# EAGLE board EvaluationBoard (EAGLE 9.3.1)
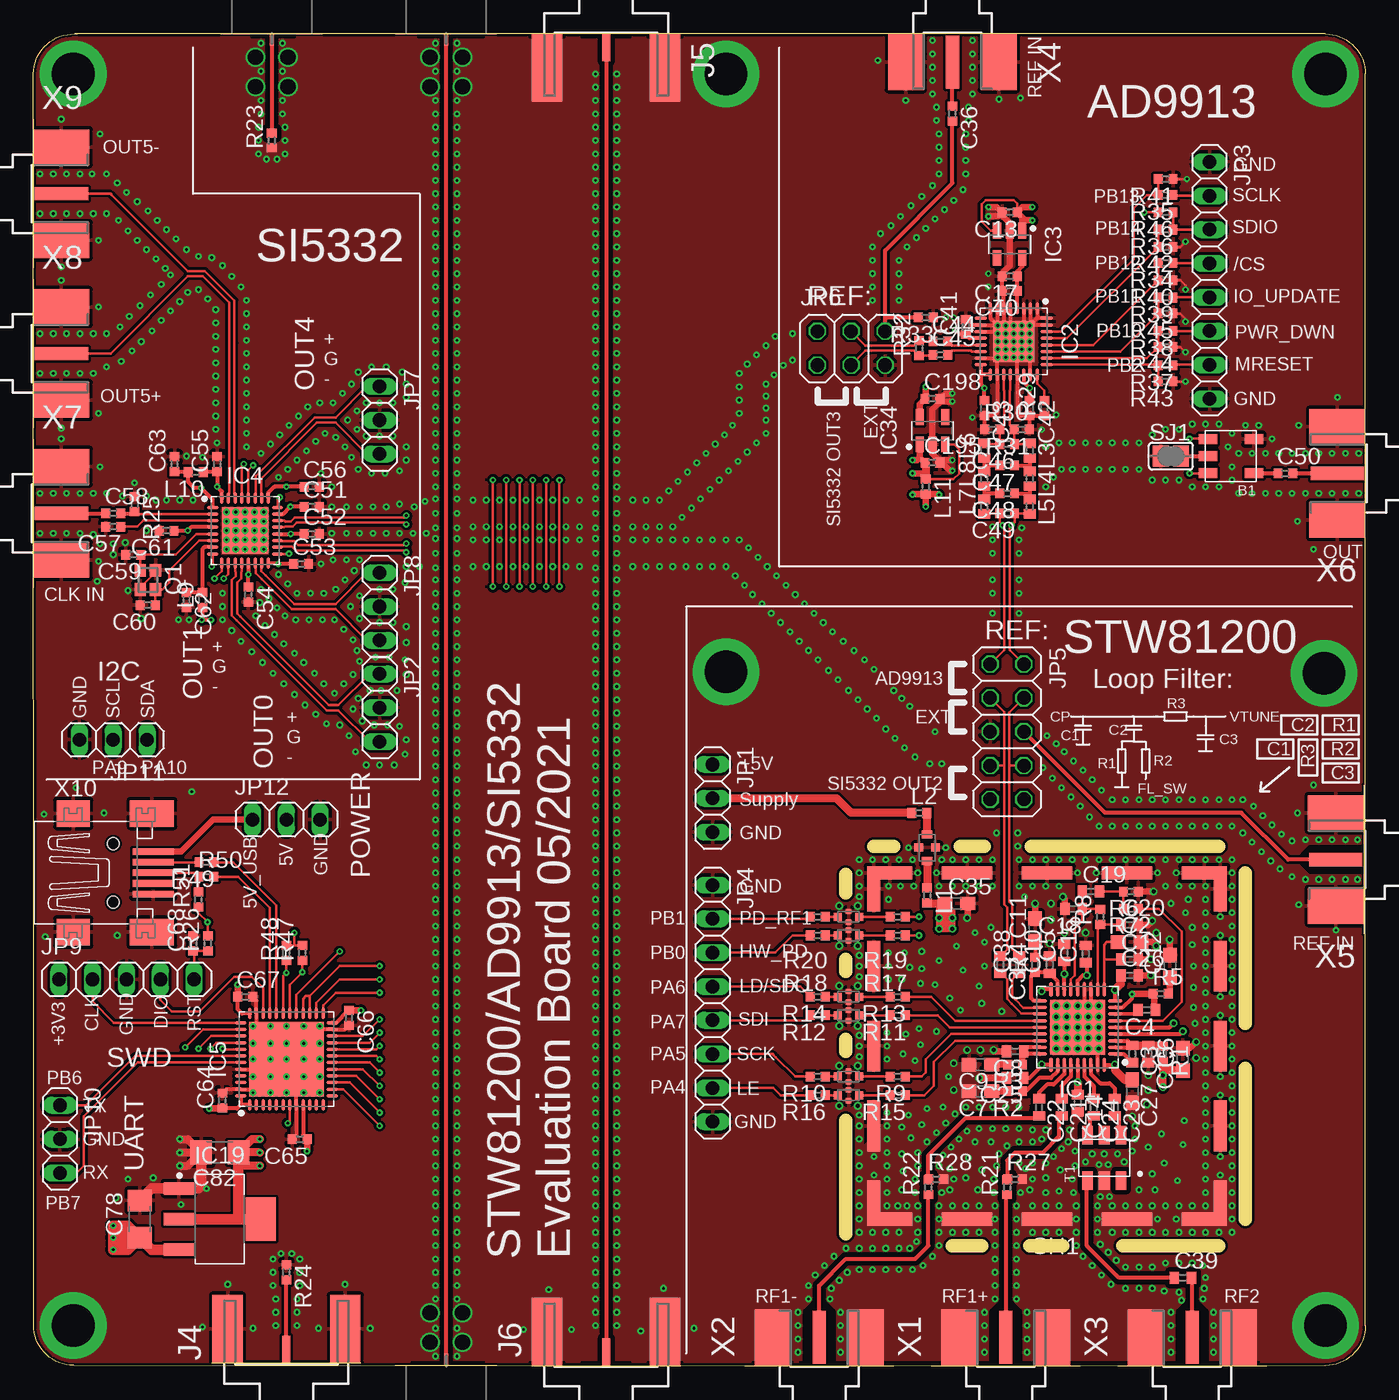
[diagram p5: board, top side]
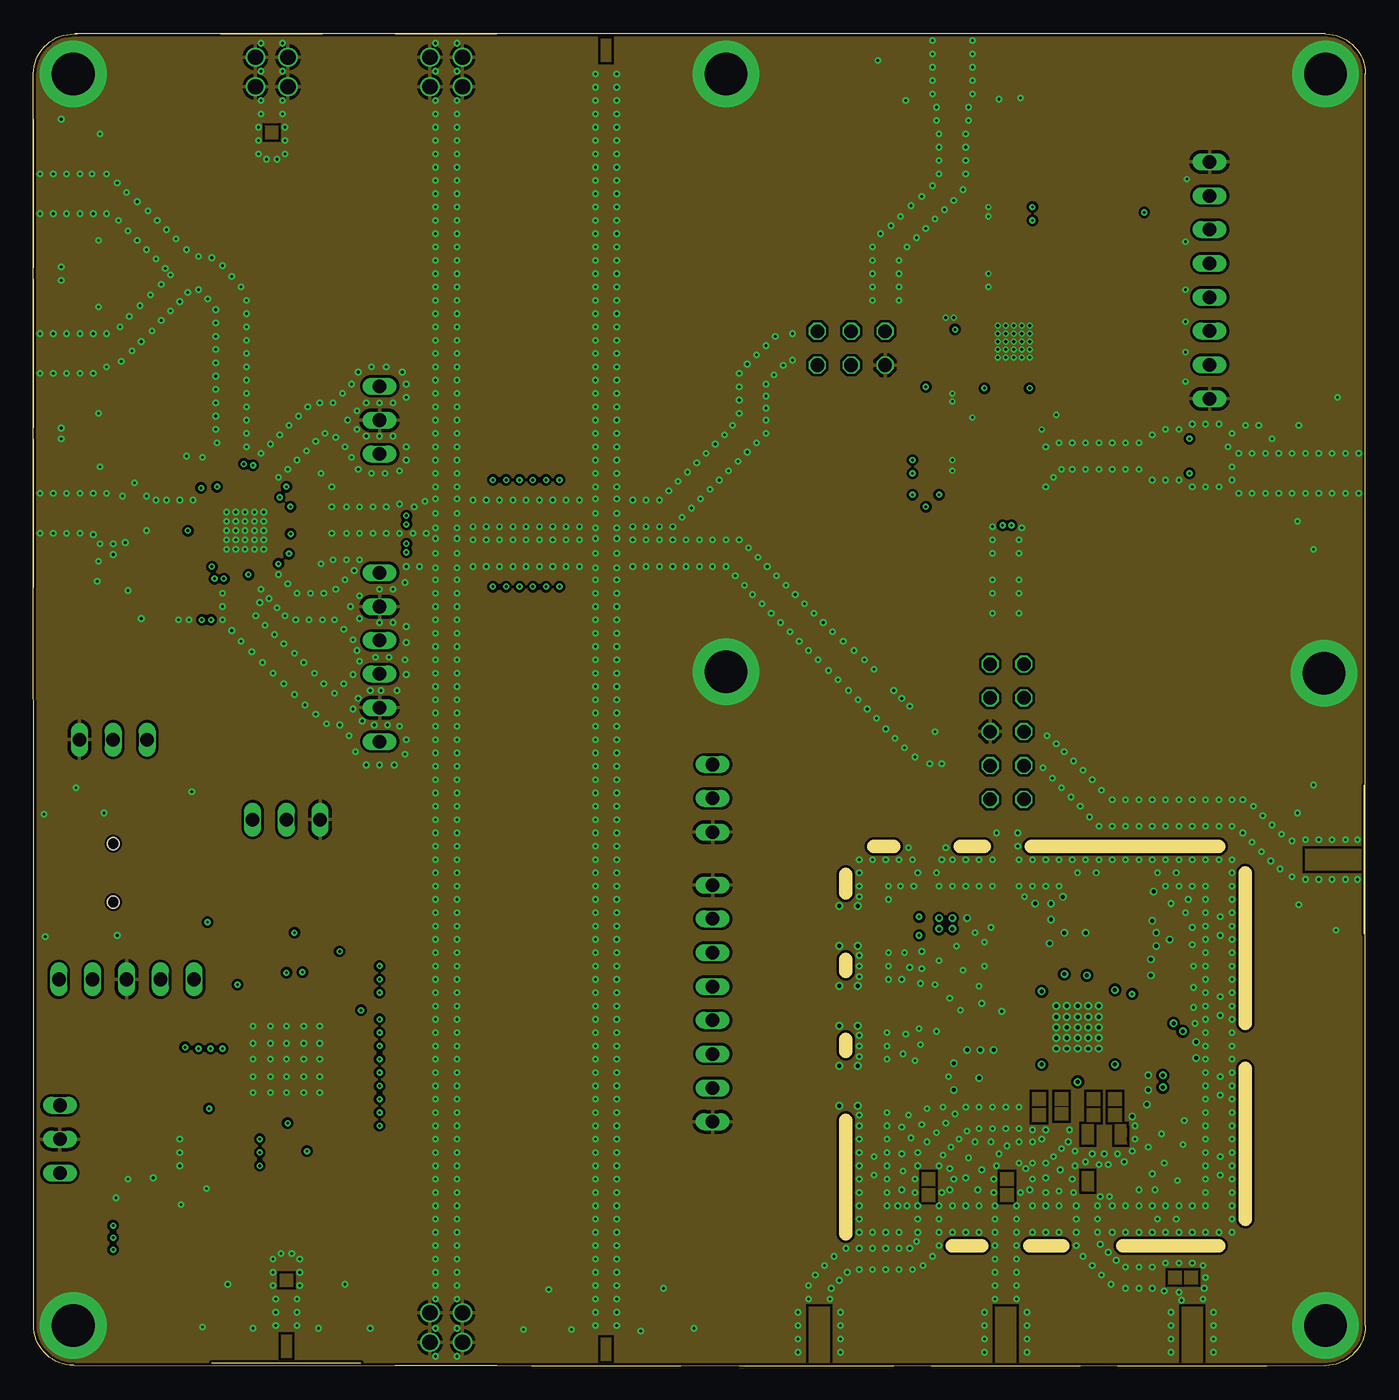
[diagram p6: board, inner layer Route2]
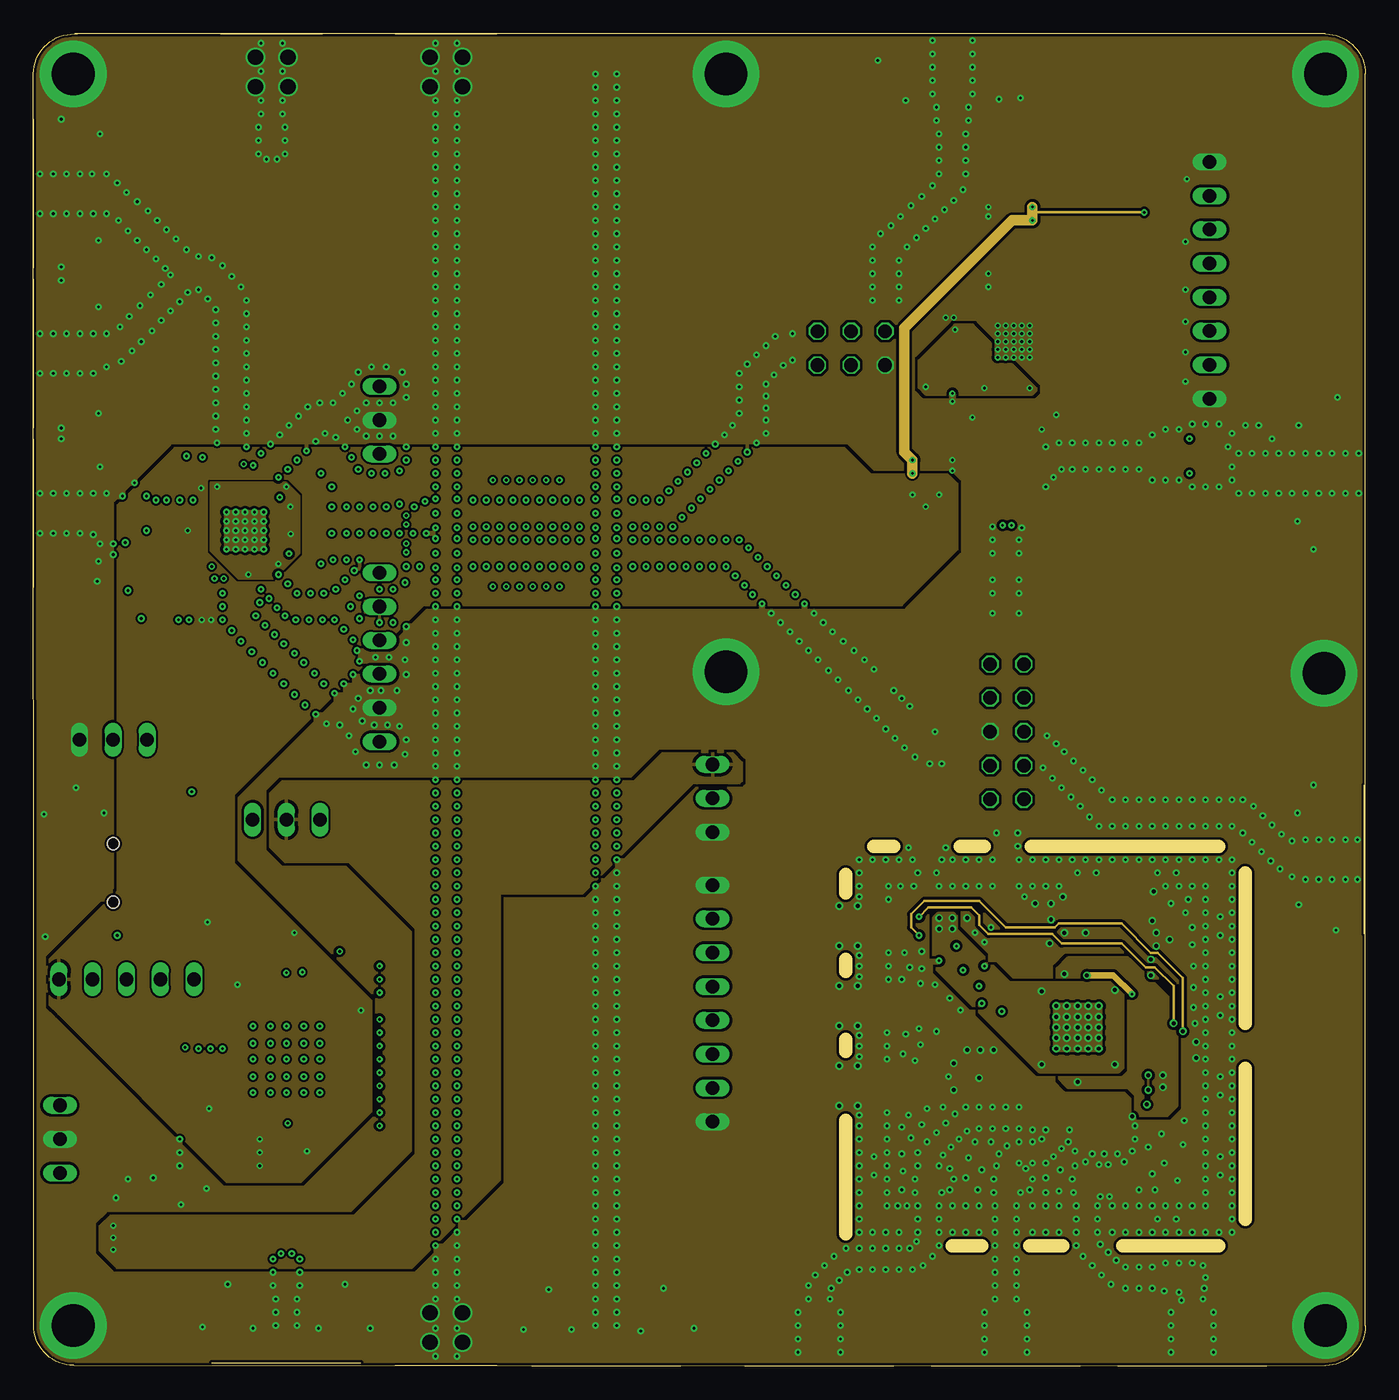
[diagram p7: board, inner layer Route15]
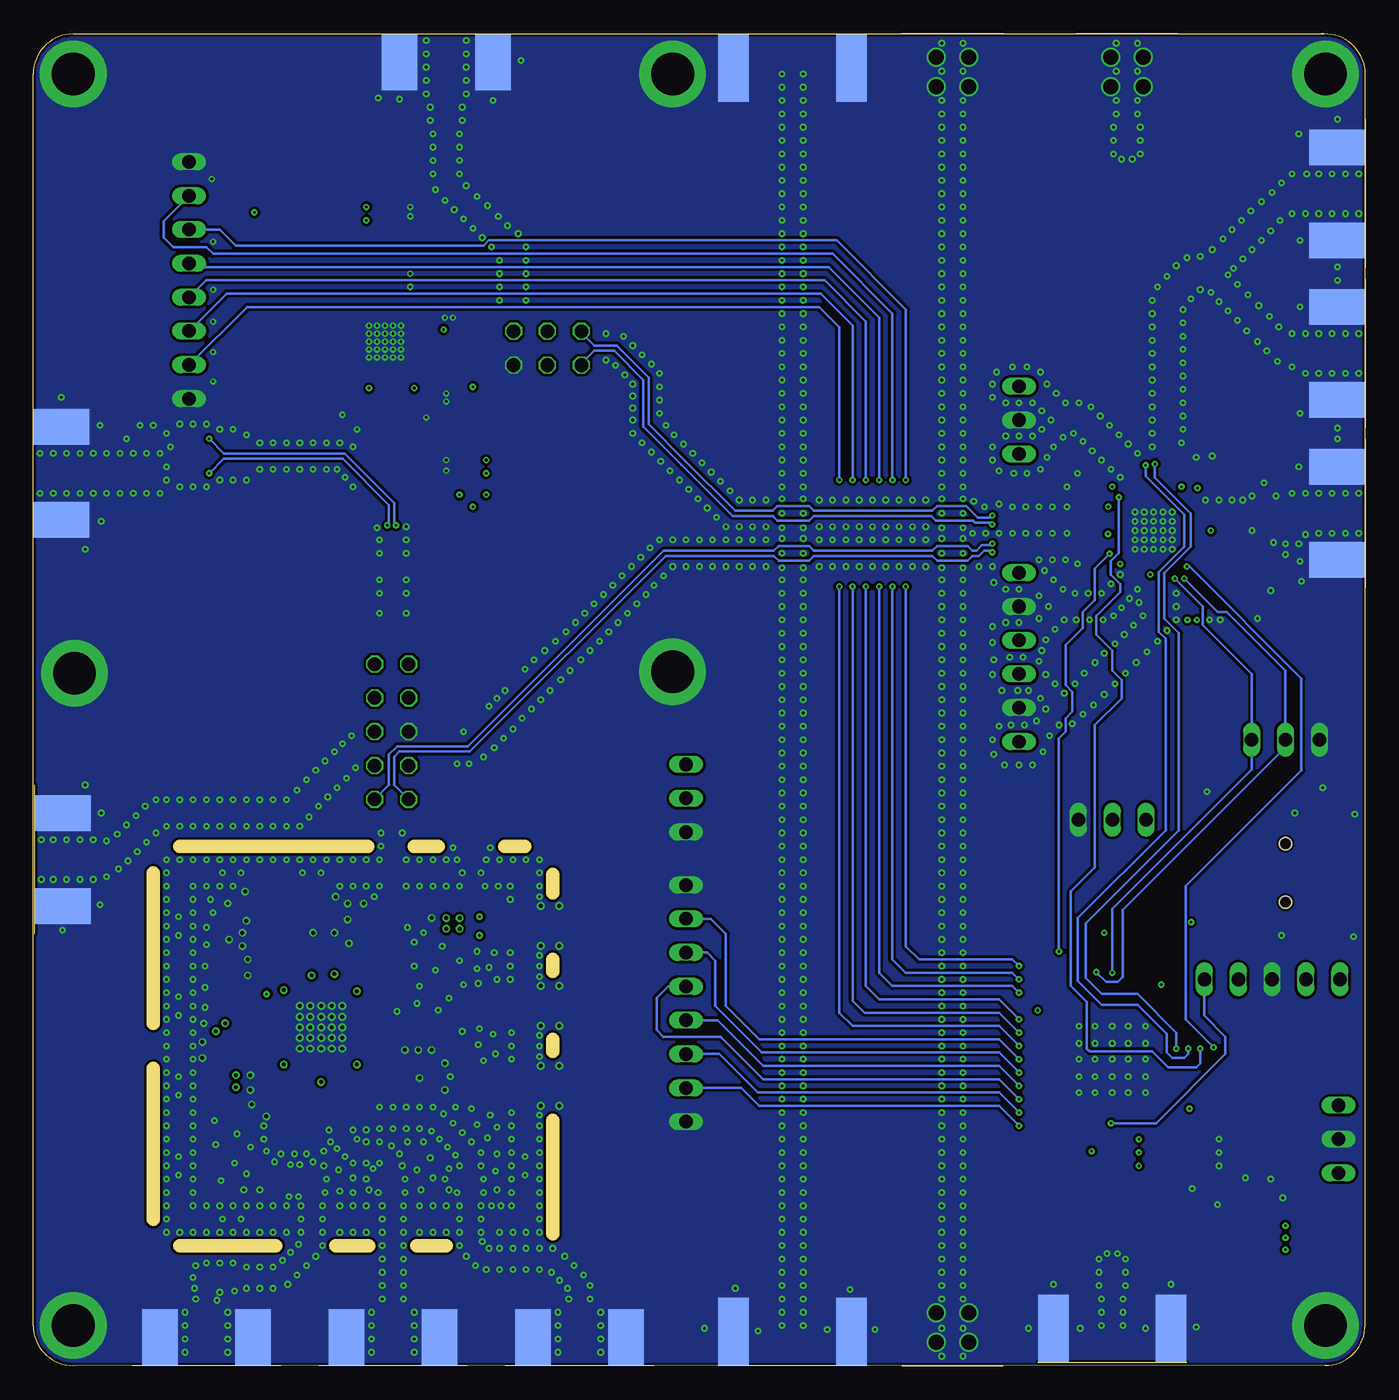
[diagram p8: board, bottom side, seen from below]

Size 100 x 100 mm. Coordinates in mm from the lower left corner, seen from the top.
Outline: 3.1,100 97,100 arc-90 100,97 100,3 arc-90 97,0 3.02,0.02 arc-90 0.02,3.02 0,97 arc-90 3.1,100
Outline: 3.1,100 3.3,100
Outline: 69,9 71.2,9
Outline: 74.8,9 77.3,9
Outline: 61,9.9 61,18.4
Outline: 61,23.6 61,24.5
Outline: 61,29.6 61,30.5
Outline: 81.8,9 89,9
Outline: 91,11 91,22.3
Outline: 91,37 91,25.7
Outline: 89,39 74.9,39
Outline: 61,35.5 61,36.9
Outline: 63.1,39 64.6,39
Outline: 69.6,39 71.4,39
Copper layers (1+2*15+16): Top 0.035mm / dielectric 0.2mm / Route2 0.0175mm / dielectric 1.064mm / Route15 0.0175mm / dielectric 0.2mm / Bottom 0.035mm
Design rules "JLCPCB4L_7628 *": minimum track width 6mil, minimum drill 0.2mm, track to track 3.5mil, track to pad 3.5mil, pad to pad 3.5mil, via to via 3.5mil, smd to smd 0mil, copper to edge 0.2mm, drill to drill 0.2mm, minimum pad ring 0.13mm, minimum via ring 0.13mm, stop-mask expansion 0.05mm, vias tented up to drill 0mil, thermal gap 10mil
Net classes: 1 100 Ohm differential: width 0.2 mm, drill 0.2 mm, clearance 0.2 mm
tRestrict: 16 lines
Milling: 12 lines

## Footprints (pad centres in the part's own frame; a part is rotated, then mirrored left to right if it is on the bottom)
SM-22 = smd 0.762 x 1.397: 1 -1.27,1.727; 2 0,1.727; 3 1.27,1.727; 4 1.27,-1.727; 5 -1.27,-1.727
C0402 = smd 0.7 x 0.9: 1 -0.65,0; 2 0.65,0
C0603 = smd 1.1 x 1: 1 -0.85,0; 2 0.85,0
C0402' = smd 0.67 x 0.72: 1 -0.56,0; 2 0.56,0
NFM18PC = smd 0.6 x 0.6: 1 -0.8,0; 3 0.8,0 | smd 0.4 x 0.4: 2 0,-0.4; 4 0,0.4
NFM21PC = smd 0.6 x 0.8: 1 -1,0; 3 1,0 | smd 0.6 x 0.65: 2 0,-0.625; 4 0,0.625
C1206 = smd 1.6 x 1.8: 1 -1.4,0; 2 1.4,0
QFN50P600X600X100-37T410N = smd 1.084 x 0.264: 1 -2.832,2; 2 -2.832,1.5; 3 -2.832,1; 4 -2.832,0.5; 5 -2.832,0; 6 -2.832,-0.5; 7 -2.832,-1; 8 -2.832,-1.5; 9 -2.832,-2; 19 2.832,-2; 20 2.832,-1.5; 21 2.832,-1; 22 2.832,-0.5; 23 2.832,0; 24 2.832,0.5; 25 2.832,1; 26 2.832,1.5; 27 2.832,2 | smd 0.264 x 1.084: 10 -2,-2.832; 11 -1.5,-2.832; 12 -1,-2.832; 13 -0.5,-2.832; 14 0,-2.832; 15 0.5,-2.832; 16 1,-2.832; 17 1.5,-2.832; 18 2,-2.832; 28 2,2.832; 29 1.5,2.832; 30 1,2.832; 31 0.5,2.832; 32 0,2.832; 33 -0.5,2.832; 34 -1,2.832; 35 -1.5,2.832; 36 -2,2.832 | smd 4.1 x 4.1: 37 0,0
QFN50P500X500X80-33T310 = smd 0.937 x 0.27: 1 -2.487,1.75; 2 -2.487,1.25; 3 -2.487,0.75; 4 -2.487,0.25; 5 -2.487,-0.25; 6 -2.487,-0.75; 7 -2.487,-1.25; 8 -2.487,-1.75; 17 2.487,-1.75; 18 2.487,-1.25; 19 2.487,-0.75; 20 2.487,-0.25; 21 2.487,0.25; 22 2.487,0.75; 23 2.487,1.25; 24 2.487,1.75 | smd 0.27 x 0.937: 9 -1.75,-2.487; 10 -1.25,-2.487; 11 -0.75,-2.487; 12 -0.25,-2.487; 13 0.25,-2.487; 14 0.75,-2.487; 15 1.25,-2.487; 16 1.75,-2.487; 25 1.75,2.487; 26 1.25,2.487; 27 0.75,2.487; 28 0.25,2.487; 29 -0.25,2.487; 30 -0.75,2.487; 31 -1.25,2.487; 32 -1.75,2.487 | smd 3.1 x 3.1: 33 0,0
SOT95P240X110-5 = smd 1.18 x 0.609: 1 -1.024,0.95; 2 -1.024,0; 3 -1.024,-0.95; 4 1.024,-0.95; 5 1.024,0.95
QFN50P500X500X100-33T345N = smd 0.86 x 0.27: 1 -2.435,1.75; 2 -2.435,1.25; 3 -2.435,0.75; 4 -2.435,0.25; 5 -2.435,-0.25; 6 -2.435,-0.75; 7 -2.435,-1.25; 8 -2.435,-1.75; 17 2.435,-1.75; 18 2.435,-1.25; 19 2.435,-0.75; 20 2.435,-0.25; 21 2.435,0.25; 22 2.435,0.75; 23 2.435,1.25; 24 2.435,1.75 | smd 0.27 x 0.86: 9 -1.75,-2.435; 10 -1.25,-2.435; 11 -0.75,-2.435; 12 -0.25,-2.435; 13 0.25,-2.435; 14 0.75,-2.435; 15 1.25,-2.435; 16 1.75,-2.435; 25 1.75,2.435; 26 1.25,2.435; 27 0.75,2.435; 28 0.25,2.435; 29 -0.25,2.435; 30 -0.75,2.435; 31 -1.25,2.435; 32 -1.75,2.435 | smd 3.45 x 3.45: 33 0,0
QFN50P700X700X60-49T560N = smd 0.86 x 0.27: 1 -3.435,2.75; 2 -3.435,2.25; 3 -3.435,1.75; 4 -3.435,1.25; 5 -3.435,0.75; 6 -3.435,0.25; 7 -3.435,-0.25; 8 -3.435,-0.75; 9 -3.435,-1.25; 10 -3.435,-1.75; 11 -3.435,-2.25; 12 -3.435,-2.75; 25 3.435,-2.75; 26 3.435,-2.25; 27 3.435,-1.75; 28 3.435,-1.25; 29 3.435,-0.75; 30 3.435,-0.25; 31 3.435,0.25; 32 3.435,0.75; 33 3.435,1.25; 34 3.435,1.75; 35 3.435,2.25; 36 3.435,2.75 | smd 0.27 x 0.86: 13 -2.75,-3.435; 14 -2.25,-3.435; 15 -1.75,-3.435; 16 -1.25,-3.435; 17 -0.75,-3.435; 18 -0.25,-3.435; 19 0.25,-3.435; 20 0.75,-3.435; 21 1.25,-3.435; 22 1.75,-3.435; 23 2.25,-3.435; 24 2.75,-3.435; 37 2.75,3.435; 38 2.25,3.435; 39 1.75,3.435; 40 1.25,3.435; 41 0.75,3.435; 42 0.25,3.435; 43 -0.25,3.435; 44 -0.75,3.435; 45 -1.25,3.435; 46 -1.75,3.435; 47 -2.25,3.435; 48 -2.75,3.435 | smd 5.6 x 5.6: 49 0,0
SOT230P700X180-4 = smd 2.265 x 0.929: 1 -3.073,2.3; 2 -3.073,0; 3 -3.073,-2.3 | smd 2.265 x 3.229: 4 3.073,0
AMPHENOL_901-10510-2 = drill 1.14 pad 1.44: G1 -1.75,1.22; G2 -3.96,1.22; G3 -3.96,-1.22; G4 -1.75,-1.22 | smd 0.9 x 0.3: S -0.45,0
BU-1420701851 = smd 2.1 x 0.6: 1 1,0 | smd 5.08 x 2.286: G@1 2.565,4.42; G@2 2.565,-4.42 | smd 5.08 x 2.286 bottom: G@3 2.565,4.42; G@4 2.565,-4.42
1X03 = drill 1.016 long: 1 -2.54,0; 2 0,0; 3 2.54,0
1X08 = drill 1.016 long: 1 -8.89,0; 2 -6.35,0; 3 -3.81,0; 4 -1.27,0; 5 1.27,0; 6 3.81,0; 7 6.35,0; 8 8.89,0
2X05 = drill 1.016 octagon: 1 -5.08,-1.27; 2 -5.08,1.27; 3 -2.54,-1.27; 4 -2.54,1.27; 5 0,-1.27; 6 0,1.27; 7 2.54,-1.27; 8 2.54,1.27; 9 5.08,-1.27; 10 5.08,1.27
2X03 = drill 1.016 octagon: 1 -2.54,-1.27; 2 -2.54,1.27; 3 0,-1.27; 4 0,1.27; 5 2.54,-1.27; 6 2.54,1.27
1X05 = drill 1.016 long: 1 -5.08,0; 2 -2.54,0; 3 0,0; 4 2.54,0; 5 5.08,0
R0402 = smd 0.67 x 0.72: 1 -0.56,0; 2 0.56,0
L0402 = smd 0.7 x 0.9: 1 -0.548,0; 2 0.548,0
FA-128 = smd 0.95 x 0.85: 1 -0.725,-0.575; 2 0.725,-0.575; 3 0.725,0.575; 4 -0.725,0.575
TE_2118718-2 = smd 3.4 x 1: 1 1.7,0.5; 5 25.3,0.5; 11 25.3,26.5; 15 1.7,26.5 | smd 3.8 x 1: 2 7.5,0.5; 3 13.5,0.5; 4 19.5,0.5; 12 19.5,26.5; 13 13.5,26.5; 14 7.5,26.5 | smd 1 x 3.4: 6 0.5,1.7; 10 0.5,25.3; 16 26.5,25.3; 20 26.5,1.7 | smd 1 x 3.8: 7 0.5,7.5; 8 0.5,13.5; 9 0.5,19.5; 17 26.5,19.5; 18 26.5,13.5; 19 26.5,7.5
SJ = smd 1.168 x 1.6: 1 -0.762,0; 2 0.762,0
EASTEVER_BALUN = smd 1.4 x 0.8: 1 -1.715,-1.25; 2 -1.715,0; 3 -1.715,1.25; 4 1.715,1.25; 5 1.715,0; 6 1.715,-1.25
J502-ND-142-0711-821/826 = smd 4 x 1: 1 2.115,0 | smd 4.191 x 2.667: G@1 2.115,3.495; G@2 2.115,-3.495 | smd 4.191 x 2.667 bottom: G@3 2.115,3.495; G@4 2.115,-3.495
32005-301 = smd 3.1 x 0.5: 1 3,1.6; 2 3,0.8; 3 3,0; 4 3,-0.8; 5 3,-1.6 | smd 2.5 x 2: M1 -3,-4.45; M2 -3,4.45 | smd 3.3 x 2: M3 2.9,4.45; M4 2.9,-4.45 | hole 0.9: 0,2.2; 0,-2.2

## Placement (x,y rotation side)
B1  ETC1-1T-2  [SM-22]  89.9,68.3 90 top
C1  220n  [C0402]  82.3,30.5 0 top
C2  10u  [C0603]  82.3,31.8 0 top
C3  100n  [C0402]  82.5,23.4 270 top
C4  100n  [C0402]  83.59,26.71 180 top
C5  220n  [C0402]  77.4,31 90 top
C6  10u  [C0603]  86.3,23 90 top
C7  10u  [C0603]  71.1,20.6 180 top
C8  220n  [C0402]  73.7,23.6 180 top
C9  10u  [C0603]  71.1,22.6 180 top
C10  220n  [C0402]  76.3,30.1 90 top
C11  10u  [C0603]  75.2,32.7 90 top
C12  10u  [C0603]  85.33,29.98 90 top
C13  1u  [C0402']  73.3,86.6 180 top
C14  220n  [C0402]  78.4,19.7 270 top
C15  1n  [C0402]  83.7,23.4 270 top
C16  10n  [C0402]  79,30.9 90 top
C17  1u  [C0402']  73.3,81.8 180 top
C18  DNP  [C0402]  78.1,34.3 180 top
C19  DNP  [C0402]  79.4,35.6 0 top
C20  DNP  [C0402]  82.3,33.1 0 top
C21  1n  [C0402]  77.2,19.4 270 top
C22  1n  [C0402]  75.5,19.4 270 top
C23  1n  [C0402]  81.2,19.4 270 top
C24  1n  [C0402]  79.6,19.4 270 top
C25  100n  [C0402]  73.7,21.6 180 top
C26  100n  [C0402]  82.3,29.3 0 top
C27  10u  [C0603]  82.5,20.6 270 top
C28  NFM18CC101R1C3D  [NFM18PC]  61.2,21.7 0 top
C29  NFM18CC101R1C3D  [NFM18PC]  61.2,26.3 0 top
C30  NFM18CC101R1C3D  [NFM18PC]  61.2,27.7 0 top
C31  NFM18CC101R1C3D  [NFM18PC]  61.2,20.3 0 top
C32  NFM18CC101R1C3D  [NFM18PC]  61.2,32.3 0 top
C33  NFM18CC101R1C3D  [NFM18PC]  61.2,33.7 0 top
C34  NFM21PC475B1A3D  [NFM21PC]  67.1,38.9 270 top
C35  10u  [C0603]  69.3,34.7 0 top
C36  100n  [C0402']  69,94 270 top
C37  10n  [C0402]  72.6,30.1 270 top
C38  10n  [C0402]  74,30.1 90 top
C39  1n  [C0402]  86.3,6.6 0 top
C40  100n  [C0402']  73.3,80.7 180 top
C41  100n  [C0402']  70,78 90 top
C42  100n  [C0402']  74.8,71.9 270 top
C43  100n  [C0402']  71.4,71.9 270 top
C44  100n  [C0402']  68.1,76.9 0 top
C45  100n  [C0402']  68.1,75.9 0 top
C46  12p  [C0402']  73.1,69.2 180 top
C47  47p  [C0402']  73.1,67.6 180 top
C48  47p  [C0402']  73.1,65.5 180 top
C49  12p  [C0402']  73.1,64 180 top
C50  1u  [C0402']  94,67 0 top
C51  100n  [C0402']  20.9,64.5 0 top
C52  100n  [C0402']  20.9,62.45 0 top
C53  100n  [C0402']  20.1,60.2 0 top
C54  100n  [C0402']  16.15,57.9 270 top
C55  100n  [C0402']  13.8,67.7 90 top
C56  100n  [C0402']  20.9,66 0 top
C57  100n  [C0402']  6,63 180 top
C58  100n  [C0402']  6,64 0 top
C59  4p  [C0402']  7.5,60.9 180 top
C60  4p  [C0402']  8.6,57.1 180 top
C61  100n  [C0402']  10,62.7 180 top
C62  1u  [C0402']  11.5,57.5 270 top
C63  1u  [C0402']  10.6,67.7 90 top
C64  100n  [C0402']  14.2,19.9 90 top
C65  100n  [C0402']  20,17 180 top
C66  100n  [C0402']  23.7,26.1 270 top
C67  100n  [C0402']  15.9,27.7 0 top
C68  100n  [C0402']  12,31.7 90 top
C78  10u  [C1206]  8,11 90 top
C82  10u  [C1206]  14,16 180 top
C195  1u  [C0402']  67.5,67.8 0 top
C198  1u  [C0402']  67.5,72.6 0 top
IC1  STW81200  [QFN50P600X600X100-37T410N]  78.4,25.4 180 top
IC2  AD9913  [QFN50P500X500X80-33T310]  73.6,76.9 270 top
IC3  NCP702-1.8  [SOT95P240X110-5]  73.3,84.2 270 top
IC4  SI5332A-GM1  [QFN50P500X500X100-33T345N]  15.9,62.7 0 top
IC5  STM32L462CE  [QFN50P700X700X60-49T560N]  19,23 90 top
IC19  AP2114H  [SOT230P700X180-4]  14,11 0 top
IC34  NCP702-1.8  [SOT95P240X110-5]  67.5,70.2 90 top
J1  AMPHENOL_901-10510-2  [AMPHENOL_901-10510-2]  17.9,100 90 top
J2  AMPHENOL_901-10510-2  [AMPHENOL_901-10510-2]  31,0 270 top
J3  AMPHENOL_901-10510-2  [AMPHENOL_901-10510-2]  31,100 90 top
J4  BU-1420701851  [BU-1420701851]  19,0.2 90 top
J5  BU-1420701851  [BU-1420701851]  43,100 270 top
J6  BU-1420701851  [BU-1420701851]  43,0 90 top
JP1  [1X03]  51,42.6 270 top
JP2  [1X03]  26,49.4 270 top
JP3  [1X08]  88.3,81.5 270 top
JP4  [1X08]  51,27.2 270 top
JP5  [2X05]  73.1,47.6 270 top
JP6  [2X03]  61.4,76.4 0 top
JP7  [1X03]  26,71 270 top
JP8  [1X03]  26,57 270 top
JP9  [1X05]  7,29 0 top
JP10  [1X03]  2,17 270 top
JP11  [1X03]  6,47 180 top
JP12  [1X03]  19,41 0 top
L1  FERRITE  [R0402]  67.1,35.3 270 top
L2  FERRITE  [R0402]  66.5,41.5 0 top
L3  LQW15AWR16J80D  [L0402]  74.8,68.7 270 top
L4  LQW15CAR27J00D  [L0402]  74.8,66.6 270 top
L5  LQW15AWR16J80D  [L0402]  74.8,64.5 270 top
L6  LQW15AWR16J80D  [L0402]  71.4,68.7 90 top
L7  LQW15AWR16J80D  [L0402]  71.4,64.5 90 top
L8  LQW15CAR27J00D  [L0402]  71.4,66.6 90 top
L9  FERRITE  [R0402]  12.7,57.5 90 top
L10  FERRITE  [R0402]  12.2,67.1 180 top
L11  FERRITE  [R0402]  67,66 270 top
Q1  FA-128 26MHz  [FA-128]  8.6,59 270 top
R1  0R2  [R0402]  84.8,23.4 270 top
R2  0R5  [R0402]  73.7,20.6 180 top
R3  0R5  [R0402]  73.7,22.6 180 top
R4  0R5  [R0402]  75.2,30.1 90 top
R5  0R2  [R0402]  84.65,27.93 0 top
R6  DNP  [R0402]  82.4,35.6 180 top
R7  DNP  [R0402]  82.4,34.3 180 top
R8  DNP  [R0402]  80.1,33.7 90 top
R9  22  [R0402]  64.9,21.7 180 top
R10  22  [R0402]  58.9,21.7 180 top
R11  22  [R0402]  64.9,26.3 180 top
R12  22  [R0402]  58.9,26.3 180 top
R13  22  [R0402]  64.9,27.7 180 top
R14  22  [R0402]  58.9,27.7 180 top
R15  22  [R0402]  64.9,20.3 180 top
R16  22  [R0402]  58.9,20.3 180 top
R17  22  [R0402]  64.9,32.3 180 top
R18  22  [R0402]  58.9,32.3 180 top
R19  22  [R0402]  64.9,33.7 180 top
R20  22  [R0402]  58.9,33.7 180 top
R21  0  [R0402]  73.1,13.4 90 top
R22  0  [R0402]  67.2,13.4 90 top
R23  [R0402]  17.9,92 90 top
R24  [R0402]  19,7 270 top
R25  49R9  [R0402]  7.6,64.7 270 top
R26  10k  [R0402]  13.1,31.7 90 top
R27  DNP  [R0402]  73.7,14 0 top
R28  DNP  [R0402]  67.8,14 0 top
R29  49R9  [R0402]  75.9,71.9 90 top
R30  49R9  [R0402]  72,70.3 0 top
R31  49R9  [R0402]  74.2,70.3 180 top
R32  100  [R0402]  66.5,76.4 90 top
R33  100  [R0402]  67,78.7 180 top
R34  1k  [R0402]  85,82.8 180 top
R35  1k  [R0402]  85,87.9 180 top
R36  1k  [R0402]  85,85.3 180 top
R37  1k  [R0402]  85,75.1 180 top
R38  1k  [R0402]  85,77.7 180 top
R39  1k  [R0402]  85,80.2 180 top
R40  1k  [R0402]  85,81.5 180 top
R41  1k  [R0402]  85,89.1 180 top
R42  1k  [R0402]  85,84 180 top
R43  1k  [R0402]  85,73.9 180 top
R44  1k  [R0402]  85,76.5 180 top
R45  1k  [R0402]  85,79 180 top
R46  10k  [R0402]  85,86.6 180 top
R47  4k7  [R0402]  20.2,31 90 top
R48  4k7  [R0402]  19,31 90 top
R49  22  [R0402]  13,37.8 180 top
R50  22  [R0402]  13,36.7 0 top
R51  1k5  [R0402]  12.4,35 90 top
SH1  TE_2118718-2  [TE_2118718-2]  89.6,37.5 180 top
SJ1  [SJ]  85.4,68.3 0 top
T1  B012-617DB-1-63-B331  [EASTEVER_BALUN]  80.4,15.6 90 top
X1  SMA_CONNECTOR  [J502-ND-142-0711-821/826]  73,0 90 top
X2  SMA_CONNECTOR  [J502-ND-142-0711-821/826]  59,0 90 top
X3  SMA_CONNECTOR  [J502-ND-142-0711-821/826]  87,0 90 top
X4  SMA_CONNECTOR  [J502-ND-142-0711-821/826]  69,100 270 top
X5  SMA_CONNECTOR  [J502-ND-142-0711-821/826]  99.9,38 180 top
X6  SMA_CONNECTOR  [J502-ND-142-0711-821/826]  100,67 180 top
X7  SMA_CONNECTOR  [J502-ND-142-0711-821/826]  0,64 0 top
X8  SMA_CONNECTOR  [J502-ND-142-0711-821/826]  0,76 0 top
X9  SMA_CONNECTOR  [J502-ND-142-0711-821/826]  0,88 0 top
X10  MINI-USB-SCHIELD-32005-301  [32005-301]  6,37 0 top

## Tracks (layer width: path | path; a pad name or v marks a point on that pad's centre or on a via)
+3V3  (via drill 0.2)
  Top 0.2: R48.2 19.6,31.56 | 19.6,31.56 R47.2 | 19.6,31.56 v19.6,32.5 | R51.1 12.4,33.98 v13.08,33.3 13.08,32.28 R26.2
  Top 0.3: IC4.4 11.85,62.95 v11.6,62.7 C61.1 | IC5.9 20.25,17.31 C65.1 | IC5.24 22.75,25.75 23.66,26.66 C66.1 | IC5.36 15.66,26.43 15.34,26.76 C67.1 | IC5.1 15.56,19.57 | 15.56,19.57 15.3,19.3 14.24,19.3 C64.1 | IC5.48 15.56,19.57 | IC4.1 13.46,65.03 v12.6,65.9 12.1,65.9 11.64,66.36 L10.2 10.64,67.1 C63.1 | v13.35,56 v12.65,56 12.7,56.05 L9.1
  Top 0.5: C67.1 15.34,28.59 v15.32,28.6 | 23.66,26.66 24.59,26.66 v24.6,26.68 | C65.1 v20.56,16.11 v20.55,16.1 | 14.24,19.3 v13.2,19.3 | v67,64.5 L11.2 | v68,65.4 67.96,65.44 L11.2 | v66,65.4 66.04,65.44 L11.2
  Top 0.6: v17,16 C82.1 16.4,17 v17,17 | v17,15 15.4,15
  Top 0.8: IC19.2 15.3,11 | 15.3,11 IC19.4 | C82.1 15.4,15 15.4,11.1 15.3,11
  pour Route15 (isolate 0.15, rank 2): 15.6,13.8 20.1,13.8 22.8,16.5 25.4,19.1 25.4,27.4 15.1,37.7 15.1,42.9 29.3,57.1 65.2,57.1 69.4,61.3 69.4,66.2 68.7,66.9 62.9,66.9 60.9,68.9 10.6,68.9 6.3,64.6 6.3,56.5 6.3,35.6 1.2,30.5 1.2,27.1 1.9,26.4 14.5,13.8
+5V  (via drill 0.2)
  Top 0.8: IC19.3 8.9,8.7 C78.1 | C78.1 v6,9.6 | C78.1 7.35,8.95 | 7.35,8.95 7.1,8.7 v6,8.7 | C78.1 7.4,10.2 | 7.4,10.2 7.1,10.5 v6,10.5 | v6,10.5 v6,9.6 | v6,9.6 v6,8.7 | v6,8.7 6.25,8.95 7.35,8.95 | v6,10.5 6.3,10.2 7.4,10.2
  pour Route15 (isolate 0.15): 5,10.5 5.8,11.3 24.1,11.3 28.7,15.9 28.7,32.8 23.7,37.8 18.9,37.8 17.8,38.9 17.8,43 18.7,43.9 45.1,43.9 47.2,46 52.5,46 53.2,45.3 53.2,43.9 53,43.7 49.5,43.7 41.2,35.4 35,35.4 35,13.9 28.4,7.3 6.3,7.3 5,8.6
AD9913_CS  (via drill 0.2)
  Top 0.2: JP3.4 85.59,82.77 R34.1 | IC5.25 21.75,27.05 22.7,28 v26,28 | v36.5,58.5 v36.5,66.5
  Bottom 0.2: v26,28 26.5,28.5 35.5,28.5 36.5,29.5 v36.5,58.5 | v36.5,66.5 36.5,78.7 40.3,82.5 88.03,82.5 JP3.4
AD9913_IO_UPDATE  (via drill 0.2)
  Top 0.2: JP3.5 85.59,80.23 R39.1 | IC5.22 24.75,24.75 v26,26 | v37.5,58.5 v37.5,66.5
  Bottom 0.2: v26,26 27.5,27.5 36.5,27.5 37.5,28.5 v37.5,58.5 | v37.5,66.5 37.5,78.4 40.6,81.5 87.03,81.5 JP3.5
AD9913_IOUT_N
  Top 0.2: IC2.19 72.85,73.25 72.9,73.2 72.9,70.9 72.9,70.64 R30.2 72.56,69.22 C46.2 71.45,69.2 L6.2
AD9913_IOUT_P
  Top 0.2: IC2.20 73.35,73.25 73.3,73.2 73.3,70.9 73.3,70.64 R31.2 73.64,69.22 C46.1 74.75,69.2 L3.1
AD9913_MRESET  (via drill 0.2)
  Top 0.2: JP3.7 85.61,75.15 R37.1 | IC5.20 25.75,23.75 v26,24 | v39.5,58.5 v39.5,66.5
  Bottom 0.2: v26,24 27.5,25.5 38.5,25.5 39.5,26.5 v39.5,58.5 | v39.5,66.5 39.5,78 41,79.5 83.95,79.5 JP3.7
AD9913_OUT_N  (via drill 0.2)
  Top 0.2: L7.1 71.45,64 C49.2 72.54,63.33 v72.77,63.1 72.9,63.1 72.9,54.1 72.9,53.75 JP5.1 | B1.3 88.14,69.6 v86.8,69.6
  Bottom 0.2: v86.8,69.6 85.7,68.5 76.62,68.5 72.9,64.78 72.9,64.58 72.9,63.1 v72.77,63.1
AD9913_OUT_P  (via drill 0.2)
  Top 0.2: L5.2 74.75,64 C49.1 73.66,63.44 73.66,63.33 v73.43,63.1 73.3,63.1 73.3,54.1 73.3,53.75 JP5.2 | v86.8,67 88.14,67 B1.1
  Bottom 0.2: v86.8,67 85.7,68.1 76.78,68.1 73.3,64.62 73.3,64.42 73.3,63.1 v73.43,63.1
AD9913_PWR_DWN  (via drill 0.2)
  Top 0.2: JP3.6 R38.1 | IC5.21 25.25,24.25 v26,25 | v38.5,58.5 v38.5,66.5
  Bottom 0.2: v26,25 27.5,26.5 37.6,26.5 38.5,27.4 v38.5,58.5 | v38.5,66.5 38.5,78.1 40.9,80.5 85.49,80.5 JP3.6
AD9913_REF_IN_N
  Top 0.2: C45.1 67.48,75.84 R32.1 66.14,76.2 62.47,76.2 JP6.3
AD9913_REF_IN_P
  Top 0.2: C44.1 66.56,76.9 R32.2 66.14,76.6 65.5,76.6 62.5,76.6 62.47,76.6 JP6.4
AD9913_REF_LVDS_N  (via drill 0.2)
  Top 0.2: IC4.21 18.85,62.95 18.9,63 19.48,63 19.78,63.3 20.9,63.3 28,63.3 v28,63.17
  Bottom 0.2: v28,63.17 28,63.3 28.7,63.3 29.3,63.3 29.4,63.4 29.45,63.45 32.25,63.45 32.6,63.8 32.7,63.8 40.1,63.8 41.4,63.8 41.75,63.45 42.73,63.45 44.15,63.45 44.5,63.8 47,63.8 47.48,63.8 51.34,67.66 54.2,70.52 54.2,74.02 56.38,76.2 57.9,76.2 58.86,75.24 JP6.1
AD9913_REF_LVDS_P  (via drill 0.2)
  Top 0.2: IC4.22 18.85,63.45 18.9,63.4 19.32,63.4 19.62,63.7 20.9,63.7 28,63.7 v28,63.83
  Bottom 0.2: v28,63.83 28,63.7 28.7,63.7 29.1,63.7 29.8,64.4 29.95,64.55 32.15,64.55 32.5,64.2 32.7,64.2 40.1,64.2 41.4,64.2 41.75,64.55 44.15,64.55 44.5,64.2 47,64.2 47.32,64.2 51.06,67.94 53.8,70.68 53.8,74.18 56.22,76.6 57.9,76.6 58.86,77.56 JP6.2
AD9913_REF_N
  Top 0.2: IC2.14 70.45,76.15 70.4,76.2 68.96,76.2 C45.2
AD9913_REF_P
  Top 0.2: IC2.13 70.45,76.65 70.4,76.6 69.3,76.6 68.96,76.6 C44.2
AD9913_SCLK  (via drill 0.2)
  Top 0.2: JP3.2 85.61,87.85 R35.1 | IC5.26 21.25,27.25 23,29 v26,29 | v35.5,58.5 v35.5,66.5
  Bottom 0.2: v26,29 26.5,29.5 34.5,29.5 35.5,30.5 v35.5,58.5 | v35.5,66.5 35.5,79 40,83.5 86.5,83.5 87,84 89.5,84 90.2,84.7 90.2,85.95 JP3.2
AD9913_SDIO  (via drill 0.2)
  Top 0.2: JP3.3 R36.1 R46.1 | 20.75,27.75 23,30 v26,30 | 20.75,27.75 IC5.27 | 20.75,27.75 20.45,27.75 20.25,27.55 IC5.28 | v34.5,58.5 v34.5,66.5
  Bottom 0.2: v26,30 26.5,30.5 33.5,30.5 34.45,31.45 | 34.45,31.45 34.5,31.5 | 34.45,31.45 34.5,31.5 | 34.5,31.5 v34.5,58.5 | v34.5,66.5 34.5,79.3 39.7,84.5 65.8,84.5 66.2,84.1 84.8,84.1 86.01,85.31 JP3.3
CUTOUT
  Route2 0: 53,0 54,0
  pour Route2 (no thermals): 59.8,0 59.8,4.4 58.2,4.4 58.2,0
  pour Route2 (no thermals): 99.9,38.8 95.5,38.8 95.5,37.2 99.9,37.2
  pour Route2 (no thermals): 73.8,0 73.8,4.4 72.2,4.4 72.2,0
  pour Route2 (no thermals): 87.8,0 87.8,4.4 86.2,4.4 86.2,0
  pour Route2 (isolate 0.36): 42.6,0 42.6,2.1 43.4,2.1 43.4,0
  pour Route2 (isolate 0.36): 18.6,0.2 18.6,2.3 19.4,2.3 19.4,0.2
  pour Route2 (isolate 0.36): 42.6,97.9 42.6,100 43.4,100 43.4,97.9
  pour Route2 (no thermals): 67.7,14.5 67.7,13.5 66.7,13.5 66.7,14.5
  pour Route2 (no thermals): 67.7,13.3 67.7,12.3 66.7,12.3 66.7,13.3
  pour Route2 (no thermals): 73.6,14.5 73.6,13.5 72.6,13.5 72.6,14.5
  pour Route2 (no thermals): 73.6,13.3 73.6,12.3 72.6,12.3 72.6,13.3
  pour Route2 (no thermals): 85.2,7.1 86.2,7.1 86.2,6.1 85.2,6.1
  pour Route2 (no thermals): 86.4,7.1 87.4,7.1 87.4,6.1 86.4,6.1
  pour Route2 (no thermals): 75,19.5 75,20.5 76,20.5 76,19.5
  pour Route2 (no thermals): 75,18.3 75,19.3 76,19.3 76,18.3
  pour Route2 (no thermals): 76.7,18.4 76.7,19.4 77.7,19.4 77.7,18.4
  pour Route2 (no thermals): 76.7,19.5 76.7,20.5 77.7,20.5 77.7,19.5
  pour Route2 (no thermals): 79.1,19.5 79.1,20.5 80.1,20.5 80.1,19.5
  pour Route2 (no thermals): 79.1,18.3 79.1,19.3 80.1,19.3 80.1,18.3
  pour Route2 (no thermals): 80.7,18.3 80.7,19.3 81.7,19.3 81.7,18.3
  pour Route2 (no thermals): 80.7,19.5 80.7,20.5 81.7,20.5 81.7,19.5
  pour Route2 (isolate 0.36): 78.7,18.1 79.6,18.1 79.6,16.6 78.7,16.6
  pour Route2 (isolate 0.36): 81.2,18.1 82.1,18.1 82.1,16.6 81.2,16.6
  pour Route2 (isolate 0.36): 78.7,14.6 79.6,14.6 79.6,13.1 78.7,13.1
  pour Route2 (no thermals): 19.5,6.9 19.5,5.9 18.5,5.9 18.5,6.9
  pour Route2 (no thermals): 18.4,93.1 18.4,92.1 17.4,92.1 17.4,93.1
GND  (via drill 0.2, 0.2 pad 0.5, 0.3 pad 0.5, 0.3 pad 0.6, 3.2 pad 5)
  Top 0.2: R41.1 v86.6,89.1 | R42.1 86.1,84 v86.5,84.4 | R40.1 86.1,81.5 86.5,81.1 v86.5,80.8 | R45.1 86.1,79 86.5,78.6 v86.5,78.4 | R44.1 86.1,76.5 v86.5,76.1 | R43.1 v86.5,73.9 | Q1.4 9.18,59.58 8.03,58.42 Q1.2
  Top 0.3: IC1.13 78.9,27.3 v79.2,27 79.4,27.2 IC1.12 | IC1.35 79.9,23.7 v80,23.8 | 72.35,78.15 IC2.10 70.41,78.15 C41.2 | 72.35,78.15 v72.4,78.1 72.35,78.15 | IC2.11 72.25,77.65 v72.4,77.5 | IC2.31 74.8,78.15 | 74.8,78.15 74.25,78.15 | 74.25,78.15 v74.2,78.1 | IC2.3 74.35,78.25 74.25,78.15 | IC2.2 74.85,78.2 74.8,78.15 | IC2.1 75.35,78.7 74.8,78.15 | IC2.32 75.35,78.65 v74.8,78.1 | IC2.5 73.35,78.35 v73.6,78.1 | v73,78.1 72.85,78.25 IC2.6 72.85,80.59 C40.2 C17.2 | IC2.7 72.35,78.15 | IC2.8 71.85,78.65 72.35,78.15 | IC2.23 74.85,76.25 v74.8,76.3 | v74.2,76.3 73.85,75.95 IC2.21 73.85,71.55 74.06,71.34 C42.2 | 72.35,75.65 IC2.18 72.35,71.55 72.14,71.34 C43.2 71.44,71.3 R30.1 | 72.35,75.65 v72.4,75.7 | R31.1 74.8,70.34 C42.2 | C42.2 R29.1 | IC2.15 72.35,75.65 | C62.2 11.54,56.9 | C65.2 19.75,17.31 IC5.8 19.75,20.55 19.7,20.6 19.8,20.5 v20.3,20.5 | v16.5,20.5 16.25,20.75 IC5.47 14.49,20.75 C64.2 | IC5.44 17.25,22.25 v17.8,21.7 | v16.5,25.5 16.75,25.75 IC5.35 16.75,27.41 C67.2 | v21.5,25.5 21.75,25.25 IC5.23 23.41,25.25 C66.2
  Top 0.5: C25.2 v71,21.6 | C8.2 72.1,23.6 v72.1,23.7 | C6.2 86.85,23.85 v87.3,24.3 | C26.2 v83.9,29.3 | C1.2 v83.9,30.5 | C2.2 84,31.8 v84.3,31.5 | C20.2 83.7,33.1 v84,33.4 | C12.2 85.33,31.97 v85.3,32 | R6.1 v84.1,35.6 | C18.2 77.45,35.05 v77.3,35.2 | C11.2 v75.2,34.7 | C35.2 70.15,33.65 v70.1,33.6 | C17.2 72.74,82.04 73.3,82.6 IC3.2 73.3,85.8 72.74,86.36 C13.2 | 68.06,67.94 C195.2 | 68.06,67.94 67.5,68.5 IC34.2 67.5,71.8 68.06,72.36 C198.2 | v71.7,87 72.34,87 C13.2 | v71.7,86.3 72.44,86.3 C13.2 | v69,72.4 68.26,72.4 C198.2 | v69,73 68.46,73 C198.2 | v69,68 68.12,68 68.06,67.94 | v69,67.2 68.8,67.2 68.06,67.94
  Top 0.6: v11,16 C82.2 | v11,17 11.6,17 C82.2 | v11,15 11.6,15 C82.2
  Top 0.8: C78.2 8.9,13.3 IC19.1 12.4,13.3 12.6,13.5 C82.2
  other vias: 78.4,25.4 76.8,25.4 77.6,25.4 77.6,24.6 78.4,24.6 78.4,23.8 77.6,23.8 76.8,23.8 76.8,24.6 76.8,26.2 76.8,27 77.6,27 77.6,26.2 78.4,26.2 78.4,27 80,27 80,26.2 79.2,26.2 79.2,25.4 80,25.4 80,24.6 79.2,24.6 79.2,23.8 79,32.5 77.4,32.5 76.3,31.7 76.4,33.5 76.4,34.7 84.3,32.5 82.5,18.7 83.6,19.6 83.7,21.8 83.7,20.7 87.3,23.1 71.1,23.7 70.1,23.7 69.1,22.7 69.1,20.7 60.6,3 59.8,5 60.6,2 60.6,1 60.6,4 62,7.2 61.1,7 60.5,6.4 59.9,5.8 63,7.2 64,7.2 65,7.2 66,7.2 65,8.8 65.8,8.8 64,8.8 63,8.8 62,8.8 61,8.8 57.4,1 57.4,2 57.4,3 57.4,4 58.2,5 58.2,6 58.7,6.8 59.4,7.5 60.1,8.2 68,9 68,10 68,11 68,12 66.4,11 66.4,10 66.3,9.3 66.4,12 66.8,7.5 67.5,8.2 74,19.4 73,19.4 72,19.4 71,19.4 70,19.4 74,17.8 75,17.7 76,17.7 73,17.8 72,17.8 71,17.8 68.2,13 68.8,13.2 69.1,14 68,15 68.8,14.8 68.3,15.8 68.9,16.4 69.5,17 70.1,17.6 66.4,16 66.4,15 66.2,14 66.2,13 67.1,16.8 67.8,17.5 68.5,18.2 69.2,18.9 75,16.8 74,16.8 75.7,17 74,15.2 75,15.2 76,15.2 76.6,15.7 77.2,16.3 77.7,16.8 77.8,17.7 72.2,5 72.2,6 72.2,7 72.2,8 72.2,9 72.2,10 72.2,11 72.2,12 73.8,12 73.8,11 73.8,10 73.8,9 73.8,8 73.8,7 73.8,6 73.8,5 71.4,1 71.4,2 71.4,3 71.4,4 74.6,4 74.6,3 74.6,2 74.6,1 72.1,13 72.1,14 72.3,15 72.5,15.9 73.1,16.5 74.1,13 74.8,13.2 75,14 74.5,14.8 78.3,11 78.3,10 78.3,9 78.8,8.2 79.5,7.5 80.2,6.8 80.9,6.1 82,5.8 83,5.8 84,5.8 84.9,5.6 86,5.5 86.2,4.9 85.4,4 85.4,3 85.4,2 85.4,1 88.6,1 88.6,2 88.6,3 88.6,4 87.8,5 87.9,5.8 88,6.6 87,7.7 87.8,7.5 86,7.7 85,7.7 84,7.4 83,7.4 82,7.4 81.3,7.9 80.7,8.5 80.1,9.1 79.9,10 79.9,11 79.9,12 80.1,12.7 80.8,12.7 78.3,12 78.1,13 78,14 78.2,15 79,15.3 80,15.1 80.7,15.1 80.4,15.9 79.5,15.9 81.4,15.9 81.9,15.3 78.2,16.1 82.7,18 82.7,17 82.5,16.1 69,12 70,12 71,12 75,12 76,12 77,12 81,12 82,12 83,12 84,12 85,12 86,12 87,12 88,12 88,13 88,14 88,15 88,16 88,17 88,18 88,19 88,20 88,21 88,22 88,23 88,24 88,25 88,26 88,27 88,28 88,29 88,30 88,31 88,32 88,36 88,35 88,34 88,33 87,36 86,36 85,36 64.1,12 64.9,12 65.6,12 64.1,13 64.1,14 64.1,15 64.1,16 64.1,17 64.1,18 64.1,19 64.1,23 64.1,24 64.1,25 64.2,29 64.2,30 64.2,31 64.2,35 64.2,36 65.1,36 66.1,36 68,36 69,36 70,36 71,36 72,36 74,36 75,36 76,36 77,36 78.4,37 79.8,37 84.4,37 85.8,37 89.1,33.7 89.1,32.3 89.1,26.3 89.1,27.7 89.1,21.7 89.1,20.3 89.1,14.3 89.1,15.7 85.8,11 84.4,11 63.1,14.3 63.1,15.7 67.8,37 66.4,37 81,10 82,10 83,10 84,10 85,10 86,10 87,10 88,10 89,10 90,10 90,11 90,12 90,13 90,14 90,15 90,16 90,17 90,18 90,19 90,20 90,21 90,22 90,23 90,24 90,25 90,26 90,27 90,28 90,29 90,30 90,31 90,32 90,33 90,34 90,35 90,36 90,37 90,38 89,38 88,38 87,38 86,38 85,38 84,38 83,38 82,38 81,38 80,38 79,38 78,38 77,38 76,38 75,38 74,38 72,38 71,38 70,38 69,38 66,38 68.2,38 68.5,38.9 65.7,38.9 65,38 64,38 63,38 62,38 62,37 62,36 62,35.2 62,30 62,30.8 62,29.2 62,24 62,24.8 62,23.2 62,18 62,18.8 62,17 62,16 62,15 62,14 62,13 62,12 62,11 62,10 63,10 64,10 65,10 60.5,19.5 61.9,19.5 60.5,22.5 61.9,22.5 60.5,25.5 61.9,25.5 60.5,28.5 61.9,28.5 60.5,34.5 61.9,34.5 60.5,31.5 61.9,31.5 69,10 70,10 71,10 75,10 76,10 77,10 73.9,39 73.9,40 72.3,40 3,97 97,97 97,3 3,3 85.9,13.9 86.3,16.6 86.4,18.4 84.7,17.4 83.7,16.4 84.9,15.2 84.2,13.2 84,14.4 83,13.2 77,13.1 76,14.1 77.1,14.7 76,13 70.9,13.2 70,14.1 71.2,14.7 70.2,15.6 70.7,16.8 71.9,16.8 65.2,13.2 65.3,14.6 65.2,15.9 65.9,17.1 65.2,17.9 65.7,18.8 67.1,19.3 66.7,18.1 68.3,19.4 68.7,21.7 66.2,22.9 67.8,25.1 66.5,25.3 66.6,24.1 65.5,24.9 65.3,23.4 87.1,30 87,31.6 87,32.9 86.5,34 86.7,35 85.4,34.7 87.1,28.4 87.1,26.9 87.2,25.7 74.4,35.2 70.7,32.5 71.4,31.8 71.9,32.9 69.6,26.7 68.8,27.6 67.7,28.6 66.6,28.7 66.7,29.8 66.7,31.1 65.4,31 65.8,29.9 65.2,29 68,30.4 69.3,31.5 69.8,29.7 71.4,30 71.2,27.2 72.7,26.6 71,28.5 30.2,5 30.2,2.8 30.2,0.7 31.8,0.7 31.8,2.8 31.8,5 31.8,6 31.8,7 31.8,8 31.8,9 31.8,10 31.8,11 31.8,12 31.8,13 31.8,14 31.8,15 31.8,16 31.8,17 31.8,18 31.8,19 31.8,20 31.8,21 31.8,22 31.8,23 31.8,24 31.8,25 31.8,26 31.8,27 31.8,28 31.8,29 31.8,30 31.8,31 31.8,32 31.8,33 31.8,34 31.8,35 31.8,36 31.8,37 31.8,38 31.8,39 31.8,40 31.8,41 31.8,42 31.8,43 31.8,44 31.8,45 31.8,46 31.8,47 31.8,48 31.8,49 31.8,50 31.8,51 31.8,52 31.8,77 31.8,78 31.8,79 31.8,80 31.8,81 31.8,82 31.8,83 31.8,84 31.8,85 31.8,86 31.8,87 31.8,88 31.8,89 31.8,90 31.8,91 31.8,92 31.8,93 31.8,94 31.8,95 31.8,53 31.8,54 31.8,55 31.8,56 31.8,57 31.8,58 31.8,59 31.8,59.9 31.8,61 31.8,62.1 31.8,62.9 31.8,64 31.8,65.1 31.8,66 31.8,67 31.8,68 31.8,69 31.8,70 31.8,71 31.8,72 31.8,73 31.8,74 31.8,75 31.8,76 30.2,6 30.2,7 30.2,8 30.2,9 30.2,10 30.2,11 30.2,12 30.2,13 30.2,14 30.2,15 30.2,16 30.2,17 30.2,18 30.2,19 30.2,20 30.2,21 30.2,22 30.2,23 30.2,24 30.2,25 30.2,26 30.2,27 30.2,28 30.2,29 30.2,30 30.2,31 30.2,32 30.2,33 30.2,34 30.2,35 30.2,36 30.2,37 30.2,38 30.2,39 30.2,40 30.2,41 30.2,42 30.2,43 30.2,44 30.2,45 30.2,46 30.2,47 30.2,48 30.2,49 30.2,50 30.2,51 30.2,52 30.2,77 30.2,78 30.2,79 30.2,80 30.2,81 30.2,82 30.2,83 30.2,84 30.2,85 30.2,86 30.2,87 30.2,88 30.2,89 30.2,90 30.2,91 30.2,92 30.2,93 30.2,94 30.2,95 30.2,53 30.2,54 30.2,55 30.2,56 30.2,57 30.2,58 30.2,59 30.2,59.9 30.2,61 30.2,62.1 30.2,62.9 30.2,64 30.2,65.1 30.2,66 30.2,67 30.2,68 30.2,69 30.2,70 30.2,71 30.2,72 30.2,73 30.2,74 30.2,75 30.2,76 30.2,97.2 30.2,99.3 31.8,99.3 31.8,97.2 42.2,96 42.2,97 43.8,97 43.8,96 42.2,5 42.2,4 42.2,3 43.8,3 43.8,4 43.8,5 18.2,3 18.2,4 18.2,5 18,6 18,7 19.8,3 19.8,4 19.8,5 20,6 20,7 20,8 18,8 18.6,8.4 19.4,8.4 17.1,99.3 17.1,97.2 18.7,97.2 18.7,99.3 42.2,6 42.2,7 42.2,8 42.2,9 42.2,10 42.2,11 42.2,12 42.2,13 42.2,14 42.2,15 42.2,16 42.2,17 42.2,18 42.2,19 42.2,20 42.2,21 42.2,22 42.2,23 42.2,24 42.2,25 42.2,26 42.2,27 42.2,28 42.2,29 42.2,30 42.2,31 42.2,32 42.2,33 42.2,34 42.2,35 42.2,36 42.2,37 42.2,38 42.2,39 42.2,40 42.2,41 42.2,42 42.2,43 42.2,44 42.2,45 42.2,46 42.2,47 42.2,48 42.2,49 42.2,50 42.2,51 42.2,52 42.2,77 42.2,78 42.2,79 42.2,80 42.2,81 42.2,82 42.2,83 42.2,84 42.2,85 42.2,86 42.2,87 42.2,88 42.2,89 42.2,90 42.2,91 42.2,92 42.2,93 42.2,94 42.2,95 42.2,53 42.2,54 42.2,55 42.2,56 42.2,57 42.2,58 42.2,59 42.2,59.9 42.2,61 42.2,62.1 42.2,62.9 42.2,64 42.2,65.1 42.2,66 42.2,67 42.2,68 42.2,69 42.2,70 42.2,71 42.2,72 42.2,73 42.2,74 42.2,75 42.2,76 43.8,6 43.8,7 43.8,8 43.8,9 43.8,10 43.8,11 43.8,12 43.8,13 43.8,14 43.8,15 43.8,16 43.8,17 43.8,18 43.8,19 43.8,20 43.8,21 43.8,22 43.8,23 43.8,24 43.8,25 43.8,26 43.8,27 43.8,28 43.8,29 43.8,30 43.8,31 43.8,32 43.8,33 43.8,34 43.8,35 43.8,36 43.8,37 43.8,38 43.8,39 43.8,40 43.8,41 43.8,42 43.8,43 43.8,44 43.8,45 43.8,46 43.8,47 43.8,48 43.8,49 43.8,50 43.8,51 43.8,52 43.8,77 43.8,78 43.8,79 43.8,80 43.8,81 43.8,82 43.8,83 43.8,84 43.8,85 43.8,86 43.8,87 43.8,88 43.8,89 43.8,90 43.8,91 43.8,92 43.8,93 43.8,94 43.8,95 43.8,53 43.8,54 43.8,55 43.8,56 43.8,57 43.8,58 43.8,59 43.8,59.9 43.8,61 43.8,62.1 43.8,62.9 43.8,64 43.8,65.1 43.8,66 43.8,67 43.8,68 43.8,69 43.8,70 43.8,71 43.8,72 43.8,73 43.8,74 43.8,75 43.8,76 18.7,95 18.7,94 17.1,95 17.1,94 16.9,93 18.9,93 18.9,92 16.9,92 16.9,91 18.9,91 18.3,90.6 17.5,90.6 73.6,76.9 74.2,76.9 74.8,76.9 74.8,77.5 74.2,77.5 73.6,77.5 73,77.5 73,76.9 72.4,76.9 72.4,76.3 73,76.3 73,75.7 73.6,76.3 73.6,75.7 74.2,75.7 74.8,75.7 52,97 52,52.1 96.9,52 17,57.3 15.9,62.7 16.6,62.7 17.3,62.7 17.3,63.4 17.3,64.1 16.6,64.1 16.6,63.4 15.9,63.4 15.9,64.1 15.2,64.1 15.2,63.4 15.2,62.7 14.5,62.7 14.5,63.4 14.5,64.1 14.5,62 14.5,61.3 15.2,62 15.2,61.3 15.9,62 15.9,61.3 16.6,62 16.6,61.3 17.3,62 17.3,61.3 21.6,60.2 22.4,62.5 22.4,64.5 22.4,66 21.6,67 8.5,62.7 6,60.9 6.9,61.8 7.1,58.2 8.1,56.1 10.9,56 11.7,56 6.7,65.3 7.6,66.3 8.5,65.3 11.5,68.3 12.7,68.2 13.8,69.3 23.5,64.5 24.5,64.5 25.5,64.5 26.5,64.5 27.5,64.7 28.6,64.5 29.4,64.9 23.5,62.5 24.5,62.5 25.5,62.5 26.5,62.5 27.5,62.5 28.5,62.5 29.5,62.5 33,65 34,65 35,65 36,65 37,65 38,65 39,65 40,65 41,65 41,63 40,63 39,63 38,63 37,63 36,63 35,63 34,63 33,63 33,62 34,62 35,62 36,62 37,62 38,62 39,62 40,62 41,62 33,60 34,60 35,60 36,60 37,60 38,60 39,60 40,60 41,60 22.5,60.5 23.5,60.5 24.5,60.5 28,60 29,60 45,65 46,65 47,65 45,63 46,63 47,63 45,62 46,62 47,62 48,62 49,62 50,62 51,62 52,62 45,60 46,60 47,60 48,60 49,60 50,60 51,60 52,60 52.7,59.3 53.4,58.6 54,57.9 54.7,57.2 55.4,56.5 56.1,55.8 56.8,55.1 57.5,54.4 58.2,53.7 58.9,53 59.7,52.2 60.4,51.5 61.2,50.7 61.9,50 62.6,49.3 63.3,48.6 64,47.8 64.7,47.1 65.4,46.4 66.2,45.7 67.3,45.2 68.2,45.2 53,62 53.7,61.4 54.4,60.7 55.1,60 55.8,59.3 56.5,58.6 57.2,57.9 57.9,57.2 58.6,56.5 59.3,55.8 60,55.1 60.8,54.4 61.6,53.7 62.4,53 63.1,52.3 64.6,50.7 65.2,50.1 65.8,49.5 67.7,47.6 72,63 72,62 72,61 74.2,62.9 74,62 74,61 72,59 72,58 74,59 74,58 74,56.5 72,56.5 47.7,65.7 48.4,66.4 49.1,67.1 49.8,67.8 50.5,68.5 51.2,69.2 51.9,69.9 52.5,70.6 53,71.5 53,72.5 53,73.5 53,74.5 53.6,75.2 54.3,75.9 55,76.6 55.7,77.3 57,77.5 57,75.5 48,63 48.7,63.7 49.4,64.4 50.1,65.1 50.8,65.8 51.5,66.5 52.2,67.2 52.9,67.9 53.6,68.6 54.3,69.3 55,70 55,71 55,71.9 55,72.8 55,73.7 55.6,74.4 56.3,75.1 65,80 65,81 65,82 65,83 65.6,84 66.3,84.7 67,85.4 67.7,86.1 68.4,86.8 69.1,87.5 69.8,88.3 70,89.5 70,90.5 70,91.5 70,92.5 70.2,93.5 70.2,94.5 70.5,95.5 70.5,96.5 70.5,97.5 70.5,98.5 70.5,99.5 67.5,99.5 67.5,98.5 67.5,97.5 67.5,96.5 67.5,95.5 67.8,94.5 67.8,93.5 68,92.5 68,91.5 68,90.5 68,89.5 63,80 63,81 63,82 63,83 63,84 63.6,85 64.4,85.6 65.1,86.3 65.9,87.1 66.7,87.8 67.5,88.6 99.4,36.5 98.5,36.5 97.5,36.5 96.5,36.5 95.5,36.5 99.4,39.5 98.5,39.5 97.5,39.5 96.5,39.5 95.5,39.5 81,40.5 82,40.5 83,40.5 84,40.5 85,40.5 86,40.5 87,40.5 88,40.5 89,40.5 90,40.5 90.8,40 91.5,39.3 92.2,38.6 92.9,37.9 93.6,37.3 94.5,36.7 94.5,39.4 93.7,39.9 93,40.6 92.3,41.3 91.6,42 90.8,42.5 90,42.5 89,42.5 88,42.5 87,42.5 86,42.5 85,42.5 84,42.5 83,42.5 82,42.5 81,42.5 80.2,43.2 79.5,44 78.8,44.7 78.1,45.4 77.4,46.1 76.1,47.3 76.8,46.7 80,40.5 79.3,41.2 78.6,42 77.9,42.7 77.2,43.4 76.5,44.1 75.8,44.9 99.5,65.5 98.5,65.5 97.5,65.5 96.5,65.5 95.5,65.5 94.5,65.5 93.5,65.5 92.5,65.5 91.5,65.5 90.5,65.5 90,66.5 90,67.5 90.5,68.5 91.5,68.5 92.5,68.5 93.5,68.5 94.5,68.5 95.5,68.5 96.5,68.5 97.5,68.5 98.5,68.5 99.5,68.5 89,66 88,66 87,66 86,66.5 85,66.5 84,66.5 83,67.3 82,67.3 81,67.3 80,67.3 79,67.3 78,67.3 77.2,67.3 76.6,66.7 76,66 89,70.7 88,70.7 87,70.7 86,70.3 85,70.3 84,69.9 83,69.3 82,69.3 81,69.3 80,69.3 79,69.3 78,69.3 77,69.3 76,69 90,70 89.7,69 91,70.6 92,70.6 93,69.6 18.4,59.4 19.1,58.7 19.8,58 20.8,58 21.8,58 22.7,58.3 23.4,59 24.1,59.7 17.1,58.3 17.7,57.6 18.3,56.9 18.9,56.3 19.7,56 20.7,56 21.7,56 22.6,56 23.3,55.3 24,54.5 23.8,57 24.5,57.8 24.5,56.1 14.2,58 14.2,57 14.2,56 14.9,55.2 15.6,54.4 16.4,53.6 17.2,52.8 18,52 18.8,51.2 19.6,50.4 20.4,49.6 21.2,48.9 22,48.2 23,48.1 23.7,47.3 24.2,46.1 25,45.1 26,45.1 27.1,45.1 27.9,45.9 28,47 27.5,48 26.6,48.1 25.6,48.1 24.7,48.4 24,49.3 24.4,50.1 25.3,50.7 26.1,50.7 27.3,50.7 28,51.9 27.9,53 28,54.3 28,55.5 27,55.8 26,55.8 26,58.3 27,58.3 27.9,58.8 16.7,56.3 17.4,55.6 18.1,54.9 18.8,54.2 19.6,53.5 20.3,52.8 21.1,52 21.8,51.2 22.6,50.5 23.3,51.2 24,51.9 24.5,52.9 25.7,53.2 26.7,53.2 24.3,53.7 0.5,74.5 1.5,74.5 2.5,74.5 3.5,74.5 4.5,74.5 5.5,75 6.6,75.4 7.4,76.2 8.1,76.9 8.9,77.7 9.6,78.5 10.3,79.2 11,79.9 11.6,80.6 12.4,80.8 13.1,80.1 13.7,79.3 13.7,78.3 13.7,77.3 13.7,76.3 13.7,75.3 13.7,74.3 13.7,73.3 13.7,72.3 13.7,71.3 13.7,70.3 16,69 16,70 16,71 16,72 16,73 16,74 16,75 16,76 16,77 16,78 16,79 16,80 15.6,81 14.9,81.8 14.2,82.6 13.4,83.2 12.4,83.3 11.5,83.8 0.5,89.5 1.5,89.5 2.5,89.5 3.5,89.5 4.4,89.5 5.5,89.5 6.3,88.8 7,88.1 7.8,87.4 8.6,86.7 9.3,86 10,85.3 10.7,84.6 0.5,86.5 1.5,86.5 2.5,86.5 3.5,86.5 4.5,86.5 5.5,86.5 6.4,86 7.1,85.2 7.8,84.5 8.5,83.8 9.2,83.1 9.9,82.4 0.5,77.5 1.5,77.5 2.5,77.5 3.5,77.5 4.5,77.5 5.5,77.5 6.5,78 7.2,78.8 8,79.6 8.8,80.4 9.6,81.2 10.3,81.9 0.5,65.5 1.5,65.5 2.5,65.5 3.5,65.5 4.5,65.5 5.5,65.5 12,65 11,65 10,65 9.2,65 0.5,62.5 1.5,62.5 2.5,62.5 3.5,62.5 4.5,62.4 5,61.7 6,61.7 17.1,68.5 17.8,69.2 18.5,69.9 19.2,70.6 19.9,71.3 20.6,72 21.5,72.3 22.5,72.3 23.2,73 23.9,73.7 24.4,74.6 25.4,75 26.5,75 27.7,74.6 28,73.7 28,72.7 27,72.3 26,72.3 25,72.3 24.3,71.7 23.6,71 24.3,70.3 25,69.8 26,69.8 27,69.8 28,69 28,68 27.5,67.2 26.4,67 25.4,67 24.4,67.3 23.9,68.2 23.4,69 22.7,69.7 21.9,70 21.2,69.4 20.5,68.7 19.8,68 19.1,67.3 18.4,66.7 19,23 21.5,23 19,20.5 21.5,20.5 19,25.5 16.5,23 17.8,23 19,24.2 19,21.7 20.3,23 20.3,24.2 20.3,25.5 21.5,24.2 21.5,21.7 20.3,21.7 17.8,20.5 16.5,21.7 17.8,24.2 17.8,25.5 16.5,24.2 70.5,71.2 76.8,71.4 75.7,70.3 71.7,81 71.7,82 68.5,78.7 69.1,78.7 4.9,79.5 2.1,81.5 2.1,82.5 4.9,84.5 5,92.5 2.1,93.6 2.1,70.4 4.9,71.5 2.1,69.6 5,67.5 4.9,60.4 4.8,58.9 0.8,41.4 3.2,43.4 5.3,41.5 11.9,43.1 6.3,32.3 0.9,32.2 13,13.3 11.1,12.1 9,14.1 7.1,14 6.2,12.6 14.6,6.1 16.5,2.8 12.7,2.9 21.4,2.8 23.4,6.1 25.3,2.8 40.4,2.7 38.7,5.7 36.8,2.7 45.6,2.6 47.3,5.8 49.6,2.8 97.8,32.7 95,34.6 94.9,41.5 96.1,43.6 97.9,72.7 95,70.6 94.9,63.4 96.1,61.3 63.4,98 65.5,95 72.5,95.1 74.1,95.2
  pour Top (isolate 0.36, no thermals): 46,0 93.1,0 93.1,10.7 81.2,22.6 68.6,22.6
  pour Route2 (isolate 0.2, rank 6): 0,0 100,0 100,100 0,100
  pour Route15 (isolate 0.2, rank 6): 62,38 90,38 90,10 62,10
  pour Top (isolate 0.2): 68,7.9 68,10.3 72.2,10.3 72.2,7.8 68.1,7.8
  pour Top (isolate 0.2): 74,7.9 74,10.3 78.2,10.3 78.2,7.8 74.1,7.8
  pour Top (isolate 0.2, rank 6): 0,0 57.4,0 57.4,5.5 60.6,8.7 64,8.7 65.6,10.3 65.6,15.9 69.4,19.7 82.2,19.7 82.9,19 82.9,13.3 80.2,10.6 80.2,8.9 81.4,7.7 88,7.7 89.3,6.4 89.3,0 100,0 100,100 45,100 45,0.2 41,0.2 41,100 34,100 34,0.2 28.1,0.2 28.7,0.8 28.7,100 19.8,100 19.8,90.8 18.9,89.9 17.2,89.9 16.2,90.9 16.2,100 0,100
  pour Top (isolate 0.36, no thermals): 14.9,100 21.5,100 21.5,91.3 19.4,89.2 16.6,89.2 16.5,89.3 14.9,90.9
  pour Top (isolate 0.36, no thermals): 28.5,100 34.2,100 34.2,0 28.2,0 28.2,99.7
  pour Top (isolate 0.36, no thermals): 37,100 49,100 49,94.3 46.1,91.4 46.1,8.2 49.2,5.1 49.2,0 36.9,0 36.9,5.5 37.9,6.5 40.2,8.8 40.2,90.1 37,93.3
  pour Bottom (isolate 0.2, rank 6, no thermals): 0,-0.1 100.3,-0.1 100.3,99.9 0,99.9
  pour Route15 (isolate 0.2, rank 6, no thermals): -0.1,-0.2 100.9,-0.2 100.9,100.1 -0.1,100.1
N$1
  Top 0.2: C2.1 80.6,31.8 80.4,31.6 80.4,30.5 | IC1.10 80.4,30.5 | C1.1 80.4,30.5
N$2
  Top 0.2: R7.1 84.5,34.3 86.2,32.6 86.2,27.3 84.8,25.9 IC1.6
N$3
  Top 0.2: C4.2 82.97,26.68
  Top 0.3: IC1.7 82.72,26.43 82.97,26.68
N$4
  Top 0.3: IC1.1 81.85,23.4 C3.2
N$5
  Top 0.2: C19.2 R6.2 R7.2
N$6
  Top 0.2: IC1.15 77.9,29 78.2,29.3 78.2,32.8 78.75,33.35 C18.1 | C18.1 C19.1 | C18.1 80.06,34.3 R8.2
N$7  (via drill 0.3 pad 0.5)
  Top 0.3: IC1.18 75.83,28.23 v75.7,28.1 | IC1.9 81.23,28.17 v81.2,28.2 | IC1.28 75.73,22.57 v75.7,22.6 75.7,22.5 74.8,21.6 C25.1 | IC1.36 81.17,22.57 v81.2,22.6
  Top 0.5: v68,32.8 68.5,32.8 | 68.5,32.8 v69,32.8 v69,33.6 69,34.15 68.62,34.52 | 68.62,34.52 C35.1 | v68,32.8 v68,33.6 68,34.7 | v68,32.8 68.5,32.8 | 68.5,32.8 68.5,34.4 68.62,34.52
  Top 0.6: v81.2,22.6 81.2,22.2 81.95,21.45 C27.1 | v81.2,28.2 81.65,28.65 C26.1 | L1.2 67.14,34.7 68,34.7 C35.1
  pour Route15 (isolate 0.2): 67.6,33.6 67.6,30 75.5,22.1 81.5,22.1 81.8,22.4 81.8,28.3 81.4,28.7 73.3,28.7 69.3,32.7 69.3,33.7 69.1,33.9 67.9,33.9
N$8
  Top 0.3: IC1.29 76.9,22.1 76.4,21.6 75.5,21.6 74.5,20.6 R2.1
N$9
  Top 0.5: R2.2 C7.1
N$10
  Top 0.3: IC1.34 79.4,21.9 80.1,21.2 80.8,21.2 81.2,20.8 C23.1
N$11
  Top 0.3: IC1.33 78.9,21.7 79.6,21 C24.1
N$12
  Top 0.3: IC1.30 77.4,21.9 76.6,21.1 76.1,21.1 75.5,20.5 C22.1
N$13
  Top 0.3: IC1.31 77.9,21.7 77.2,21 C21.1
N$14
  Top 0.2: C28.1 R10.1
N$15
  Top 0.2: R9.2 C28.3
N$16
  Top 0.2: R12.1 C29.1
N$17
  Top 0.2: R11.2 C29.3
N$18
  Top 0.2: C30.1 R14.1
N$19
  Top 0.2: C30.3 R13.2
N$20
  Top 0.2: R16.1 C31.1
N$21
  Top 0.2: C31.3 R15.2
N$22
  Top 0.2: C32.1 R18.1
N$23
  Top 0.2: C32.3 R17.2
N$24
  Top 0.2: C33.1 R20.1
N$25
  Top 0.2: R19.2 C33.3
N$26
  Top 0.2: IC1.24 68.9,24.9 67,23 67,22 66.7,21.7 R9.1
N$27
  Top 0.2: IC1.23 68.8,25.4 67.9,26.3 R11.1
N$28
  Top 0.2: IC1.22 69.2,25.9 67.4,27.7 R13.1
N$29
  Top 0.2: IC1.25 69.2,24.4 67.6,22.8 67.6,21 66.9,20.3 R15.1
N$30  (via drill 0.2 pad 0.5, 0.3 pad 0.5)
  Top 0.2: R17.1 v66.5,32.3
  Top 0.3: IC1.4 86.1,24.9 v86.3,25.1
  Route15 0.2: v86.3,25.1 86.3,29.1 84.4,31 83.9,31 81.7,33.2 77,33.2 76.7,32.9 73,32.9 71,34.9 66.9,34.9 65.9,33.9 65.9,32.9 v66.5,32.3
N$31  (via drill 0.2 pad 0.5, 0.3 pad 0.5)
  Top 0.2: R19.1 v66.5,33.7
  Top 0.3: IC1.5 85.3,25.4 v85.6,25.7
  Route15 0.2: v85.6,25.7 85.6,28.5 84.2,29.9 83.5,29.9 81.7,31.7 77.2,31.7 76.5,32.4 71.7,32.4 71,33.1 71,33.8 70.4,34.4 67.2,34.4 v66.5,33.7
N$32
  Top 0.6: C34.3 L1.1
N$33
  Top 0.6: C34.1 67.1,41.56 L2.2
N$34
  Top 0.3: X2.1 59,6 61,8 66.2,8 67.2,9 R22.1
N$35
  Top 0.3: R22.2 67.2,15.8 69.9,18.5 70,18.6 75.35,18.6 75.42,18.68 C22.2
  Top 0.5: R22.2 R28.1
N$36
  Top 0.3: C23.2 81.5,18.45 81.5,17.46 T1.6
N$37
  Top 0.3: T1.3 79.1,13.84 79.1,9 81.5,6.6 C39.1
N$38
  Top 0.3: C21.2 77,18.55 77,17.2 75.8,16 73.7,16 73.1,15.4 73.1,14.04 R27.1 R21.2
N$39
  Top 0.2: R21.1 73,12.74
  Top 0.3: 73,12.74 X1.1
N$40
  Top 0.3: X3.1 87,6.55 C39.2
N$41
  Top 0.3: J1.S R23.2
N$42
  Top 0.3: JP5.6 80.47,41.5 90.7,41.5 94.2,38 X5.1
N$43
  Top 0.2: IC4.3 8.25,63.45 7.8,63 C57.1
N$44
  Top 0.2: IC4.2 7.79,63.95 R25.2
  Top 0.3: C58.2 7.46,64 R25.2
N$45
  Top 0.3: X7.1 C58.1
N$46
  Top 0.2: IC4.6 12.45,61.95 10.2,59.7 10.2,58.8 9.68,58.27 Q1.3 C60.1
N$47
  Top 0.6: L2.1 61.4,41.5 60.3,42.6 JP1.2
N$49
  Top 0.5: X10.1 11.1,38.6 13.5,41 JP12.1
N$51  (via drill 0.2)
  Top 0.2: IC34.3 69.12,69.17 69.5,68.8 69.5,67 69.06,66.56 L11.1 | IC3.3 71.88,85.22 71.2,85.9 71.2,87.2 71.5,87.5 73.6,87.5 73.86,87.24 C13.1 | R46.2 v83.4,86.6
  Top 0.5: IC3.1 74.25,86.21 C13.1 | IC34.1 66.55,68.19 | 66.55,68.19 C195.1 | v75,87 74.26,87 C13.1 | v75,86 74.46,86 C13.1 | v66,67 67,67 | v66,68 66.36,68 66.55,68.19
  Top 0.6: C195.1 67,67.74 67,67 L11.1
  Route15 0.2: v83.4,86.6 75,86.6
  Route15 0.8: v66,67 v66,68 65.4,68.6 65.4,77.9 73.5,86 v75,86 75,86.6 v75,87
N$54
  Top 0.3: C24.2 79.3,18.45 79.3,17.46 T1.4
N$55
  Top 0.3: J2.S J3.S
N$56
  Top 0.3: J4.1 R24.2
N$57
  Top 0.3: J5.1 J6.1
N$58
  Top 0.3: IC2.4 C40.1 C17.1 73.86,82.16 74.25,82.55 IC3.5
N$59
  Top 0.2: IC2.24 75.35,73.75 75.9,73.2 R29.2
N$60
  Top 0.2: IC4.5 12.25,62.45 10.7,60.9 C59.1 8.03,60.87 Q1.1
N$61
  Top 0.2: IC5.37 6.05,25.75 4.46,27.34 JP9.2
N$62
  Top 0.3: IC4.7 12.85,61.45 12.7,61.3 L9.2 C62.1
N$63
  Top 0.2: IC5.34 17.25,28.35 16.4,29.2 15.1,29.2 12.5,26.6 10.4,26.6 9.54,27.46 JP9.4
N$64  (via drill 0.2)
  Top 0.2: R26.1 C68.1 12.08,31.06 JP9.5 | IC5.7 19.25,18.35 v19.1,18.2
  Bottom 0.2: v19.1,18.2 15.7,18.2 10.5,23.4 10.5,24.7 12.08,26.28 JP9.5
N$66
  Top 0.3: JP6.6 63.94,78.6 | 63.94,78.6 63.94,83.74 69,88.8 C36.2 | R33.2 64.04,78.7 63.94,78.6
N$67
  Top 0.2: IC2.28 79.59,76.65 R40.2 R34.2
N$68
  Top 0.2: IC2.30 77.15,77.65 82.6,83.1 82.6,86.9 83.6,87.9 R35.2 R41.2
N$69
  Top 0.2: IC2.29 77.59,77.15 R42.2 R36.2
N$70
  Top 0.2: IC2.25 84.39,75.15 R37.2 R43.2
N$71
  Top 0.2: IC2.26 83.59,75.65 R44.2 R38.2
N$72
  Top 0.2: IC2.27 81.59,76.15 R45.2 R39.2
N$73
  Top 0.3: L3.2 74.8,67.6 | 74.8,67.6 L4.1 | C47.1 74.8,67.6
N$74
  Top 0.3: L6.1 71.4,67.6 | 71.4,67.6 L8.2 | C47.2 71.4,67.6
N$75
  Top 0.3: L8.1 71.4,65.5 | 71.4,65.5 L7.2 | C48.2 71.4,65.5
N$76
  Top 0.3: L4.2 74.8,65.5 | 74.8,65.5 L5.1 | C48.1 74.8,65.5
N$77
  Top 0.3: SJ1.2 B1.2
N$78
  Top 0.3: X6.1 C50.2
N$79
  Top 0.3: C36.1 X4.1
N$80
  Top 0.3: C50.1 91.66,67 B1.5
N$185
  Top 0.2: X10.2 R49.2
N$186
  Top 0.2: X10.3 12.14,37 R50.1 12.4,36.66 R51.2
N$187
  Top 0.2: IC5.32 18.25,34.55 15,37.8 R49.1
N$188
  Top 0.2: IC5.33 17.75,34.35 15.4,36.7 R50.2
N$205  (via drill 0.2)
  Top 0.3: IC2.22 74.35,73.85 v74.8,73.4 C42.1 | IC2.12 70.29,77.15 C41.1 69.56,77.44 v69.2,77.8 | C43.1 v71.4,73.4 71.11,73.69 71.11,74.4 | IC2.16 71.11,74.4 | IC2.17 71.12,74.41 71.11,74.4
  Top 0.5: IC34.5 66.55,72.21 C198.1 67,72.66 v67,73.5
  pour Route15 (isolate 0.2): 67,73 75,73 75.3,73.3 70.5,78.1 69.2,78.1 66.5,75.4 66.5,73.5
OUT0_N
  Top 0.2: IC4.11 15.15,59.65 15.2,59.6 15.2,59.28 14.9,58.98 14.9,57.4 14.9,56.32 15.26,55.96 22.02,49.2 22.9,49.2 25.24,46.86 JP2.3
OUT0_P
  Top 0.2: IC4.12 15.65,59.65 15.6,59.6 15.6,59.12 15.3,58.82 15.3,57.4 15.3,56.48 15.54,56.24 22.18,49.6 22.9,49.6 25.24,51.94 JP2.1
OUT1_N
  Top 0.2: IC4.14 16.7,60.22 16.7,59.9 16.7,59.52 17.16,59.06 19.42,56.8 22.7,56.8 25.04,54.46 JP8.3
OUT1_P
  Top 0.2: IC4.15 17.1,60.22 17.1,59.9 17.1,59.68 17.44,59.34 19.58,57.2 22.7,57.2 25.04,59.54 JP8.1
OUT4_N
  Top 0.2: JP7.3 25.04,68.46 22.7,70.8 21.28,70.8 17.1,66.62 17.1,66 17.1,65.19 IC4.26
OUT4_P
  Top 0.2: JP7.1 25.04,73.54 22.7,71.2 21.12,71.2 16.7,66.78 16.7,66 16.7,65.19 IC4.27
OUT5_N
  Top 0.2: IC4.30 15.15,65.45 15.1,65.5 15.1,76.8 15.1,79.98 12.88,82.2 11.6,82.2 5.9,87.9 5.8,88 X9.1
OUT5_P
  Top 0.2: IC4.31 14.65,65.45 14.7,65.5 14.7,76.8 14.7,79.82 12.72,81.8 11.6,81.8 5.8,76 X8.1
RX
  Top 0.2: IC5.43 7.85,22.75 3.8,18.7 3.8,15 3.26,14.46 JP10.3
SCL  (via drill 0.2)
  Top 0.2: IC4.9 14.15,59.65 v13.6,59.1 | IC5.30 19.25,28.59 v20.2,29.54 R47.1
  Bottom 0.2: v20.2,29.54 19.46,28.8 18.6,28.8 18.2,29.2 18.2,34.2 6,46.4 6,46.8 | 6,46.8 JP11.2 | v13.6,59.1 11.1,56.6 10.4,56.6 6,52.2 6,46.8
SDA  (via drill 0.2)
  Top 0.2: IC4.10 14.65,59.45 v14.3,59.1 | IC5.31 18.75,29.25 v19,29.5 R48.1
  Bottom 0.2: v19,29.5 19,34.3 8.54,44.76 8.54,46.8 | 8.54,46.8 JP11.1 | v14.3,59.1 12.2,57 12.2,55.6 8.54,51.94 8.54,46.8
SI5332_IN1  (via drill 0.2)
  Top 0.2: IC4.8 13.46,60.06 v13.4,60 | IC5.38 12.75,25.25 v11.4,23.9
  Bottom 0.2: v11.4,23.9 13.5,26 13.5,36 4.8,44.7 4.8,51.6 13.2,60 v13.4,60
SI5332_IN2  (via drill 0.2)
  Top 0.2: IC4.17 19.18,60.95 v19.2,60.97 | IC5.29 19.75,27.85 v23,31.1
  Bottom 0.2: v19.2,60.97 20.3,59.87 20.3,57.5 21.2,56.6 21.2,55.4 22.5,54.1 22.5,51.1 22,50.6 22,49.1 22.5,48.6 22.5,47.6 23,47.1 v23,31.1
SI5332_IN3  (via drill 0.2)
  Top 0.2: IC4.24 18.34,65.03 v18.5,65.2 | IC5.39 13.35,24.75 v12.4,23.8
  Bottom 0.2: v12.4,23.8 12.4,22.7 12.7,22.4 14.8,22.4 16,23.6 20.7,23.6 20.9,23.8 20.9,27.3 22.1,28.5 22.1,35.6 20.3,37.4 20.3,48.1 18.3,50.1 18.3,51.5 19,52.2 19,53.7 20.2,54.9 20.2,56.3 18.4,58.1 18.4,58.7 19.1,59.4 19.1,60.4 18.5,61 v18.5,65.2
SI5332_IN4  (via drill 0.2)
  Top 0.2: IC4.28 16.15,67.25 v16.5,67.6 | IC5.40 13.75,24.25 v13.3,23.8
  Bottom 0.2: v16.5,67.6 16.5,66.8 13.6,63.9 13.6,61.5 15.5,59.6 15.5,55.1 15,54.6 15,40.2 21.6,33.6 21.6,28.9 19.8,27.1 17.1,27.1 14.9,24.9 14.9,23.5 14.5,23.1 13.6,23.1 13.3,23.4 v13.3,23.8
SI5332_IN5  (via drill 0.2)
  Top 0.2: IC4.29 15.65,67.55 v15.8,67.7 | IC5.41 14.25,23.75 v14.2,23.8
  Bottom 0.2: v14.2,23.8 14.2,25 17.1,27.9 19.8,27.9 21,29.1 21,33.2 14,40.2 14,55 15.1,56.1 15.1,59.5 13.1,61.5 13.1,64 15.8,66.7 v15.8,67.7
SI5332_VDDO  (via drill 0.2)
  Top 0.3: IC4.13 v16.15,59.4 C54.1 | IC4.16 18.34,60.27 v18.4,60.2 C53.1 | IC4.20 v19.32,62.45 C52.1 | IC4.23 18.75,63.95 v19.3,64.5 C51.1 | IC4.25 17.65,65.55 18.1,66 v19,66 C56.1 | IC4.32 14.15,65.65 v13.8,66 C55.1 13.76,67.1 L10.1
  pour Route15 (isolate 0.2): 13.3,66.3 13.3,61.2 15.4,59.1 18.1,59.1 20,61 20,65.3 19,66.3
STW81200_C_N
  Top 0.2: C38.2 73.5,31.25 73.5,31.4 73.5,34.58 73.28,34.81 73.28,37.05 73.28,43.7 73.28,44.01 73.28,45.1 | 73.28,45.1 73.28,49.05 JP5.4 | JP5.8 73.31,45.06 73.28,45.1
STW81200_C_P
  Top 0.2: C37.1 73.1,31.25 73.1,31.4 73.1,34.42 72.88,34.64 72.88,44.05 72.88,45.1 | 72.88,45.1 72.88,49.09 JP5.3 | JP5.7 72.83,45.06 72.88,45.1
STW81200_CLK_N
  Top 0.2: IC1.20 75.52,26.85 74.78,26.85 74.33,26.85 73.74,27.44 73.5,27.68 73.5,29 73.95,29.45 C38.1
STW81200_CLK_P
  Top 0.2: IC1.21 75.52,26.45 74.78,26.45 74.17,26.45 73.46,27.16 73.1,27.52 73.1,29 72.65,29.45 C37.2
STW_HW_PD  (via drill 0.2)
  Top 0.2: R18.2 57,32.3 55.71,31.01 JP4.3 | IC5.18 25.25,22.75 v26,22
  Bottom 0.2: v26,22 27.5,23.5 45.3,23.5 48.8,27 48.8,30.4 49.41,31.01 JP4.3
STW_LD_SDO  (via drill 0.2)
  Top 0.2: JP4.4 57.57,28.47 R14.2 | IC5.16 24.25,21.75 v26,20
  Bottom 0.2: v26,20 27.5,21.5 45.2,21.5 48.4,24.7 52.7,24.7 53.2,25.2 53.2,27.6 52.33,28.47 JP4.4
STW_LE  (via drill 0.2)
  Top 0.2: R16.2 56.1,20.3 55.55,20.85 JP4.7 | IC5.14 23.25,20.75 v26,18
  Bottom 0.2: v26,18 27.5,19.5 45.5,19.5 46.85,20.85 JP4.7
STW_PD_RF1  (via drill 0.2)
  Top 0.2: 58.19,33.55 JP4.2 | IC5.19 25.75,23.25 v26,23
  Top 0.3: R20.2 58.19,33.55
  Bottom 0.2: v26,23 27.5,24.5 45.5,24.5 48,27 48,32.4 49.15,33.55 JP4.2
STW_REF_N  (via drill 0.2)
  Top 0.2: IC4.18 18.65,61.45 18.7,61.5 19.3,61.5 19.42,61.5 19.72,61.2 23.2,61.2 28,61.2 v28,61.07
  Bottom 0.2: v28,61.07 28,61.2 28.62,61.2 29.02,60.8 29.5,60.8 29.85,60.45 32.15,60.45 32.5,60.8 33.1,60.8 41.4,60.8 41.75,60.45 44.05,60.45 44.4,60.8 44.6,60.8 52.52,60.8 67.22,46.1 67.8,46.1 | JP5.9 72.9,43.59 72.9,45.72 72.52,46.1 72.1,46.1 68.3,46.1 | 67.8,46.1 68.3,46.1 | 68.3,46.1 67.8,46.1 | 67.8,46.1 67.4,46.1
STW_REF_P  (via drill 0.2)
  Top 0.2: IC4.19 18.65,61.95 18.7,61.9 19.3,61.9 19.58,61.9 19.88,61.6 23.2,61.6 28,61.6 v28,61.73
  Bottom 0.2: v28,61.73 28,61.6 28.78,61.6 29.18,61.2 29.5,61.2 29.85,61.55 32.15,61.55 32.5,61.2 33.1,61.2 41.4,61.2 41.75,61.55 44.05,61.55 44.4,61.2 44.6,61.2 52.5,61.2 52.68,61.2 67.38,46.5 72.68,46.5 73.3,45.88 73.3,45.6 73.3,43.6 73.3,43.59 JP5.10
STW_SCK  (via drill 0.2)
  Top 0.2: R10.2 57.2,21.7 55.75,23.15 55.6,23.3 | 55.55,23.35 55.6,23.3 | JP4.6 55.51,23.39 55.6,23.3 | IC5.15 23.75,21.25 v26,19
  Bottom 0.2: v26,19 27.5,20.5 45.6,20.5 48.49,23.39 JP4.6
STW_SDI  (via drill 0.2)
  Top 0.2: JP4.5 57.97,25.93 R12.2 | IC5.17 24.75,22.25 v26,21
  Bottom 0.2: v26,21 27.5,22.5 45.2,22.5 48.63,25.93 JP4.5
TX
  Top 0.2: IC5.42 7.65,23.25 3.94,19.54 JP10.1
VREG_4V5  (via drill 0.3 pad 0.5)
  Top 0.3: IC1.16 v77.4,29.4 C5.1 | IC1.32 v78.4,21.3
  Top 0.6: R1.2 84.8,22.1 | 84.8,22.1 v84.8,21.8 v84.8,20.9 | C6.1 84.85,22.15 84.8,22.1 | v78.4,21.3 C14.1
  pour Route15 (isolate 0.2, rank 2): 76.9,29.8 77.7,30.6 82.2,30.6 85.8,27 85.8,19.5 85.1,18.8 83.1,18.8 82.8,19.1 82.8,20.3 82.2,20.9 77.7,20.9 76.9,21.7
VREG_4V5_DIRECT
  Top 0.3: IC1.3 82.15,24.4 C3.1 82.35,23.9 IC1.2
  Top 0.6: C3.1 C15.1 84.71,24.05 R1.1
VREG_DIG
  Top 0.5: R3.2 C9.1
VREG_DIG_DIRECT
  Top 0.3: IC1.26 74.35,23.9 C8.1 74.35,23.4 IC1.27
  Top 0.5: C8.1 74.26,23.6 R3.1
VREG_REF
  Top 0.3: C11.1 R4.2
VREG_REF_DIRECT
  Top 0.3: IC1.19 75.1,27.4 74.9,27.6 74.9,29.24 R4.1 76.21,29.54 C10.1 76.9,28.85 IC1.17
VREG_VCO
  Top 0.5: C12.1 85.33,28.05 R5.2
VREG_VCO_DIRECT  (via drill 0.2 pad 0.5, 0.3 pad 0.5)
  Top 0.3: IC1.14 78.4,28.9 78.8,29.3 v79.1,29.3 | 79,29.4 v79.1,29.3 | C16.1 79.1,30.15 v79.1,29.3 | IC1.8 81.8,26.9 82.49,27.59 v82.49,27.9
  Top 0.5: v82.49,27.9 84.06,27.9 R5.1 84.15,27.87 84.15,26.8 C4.1
  Route15 0.5: v82.49,27.9 81.09,29.3 v79.1,29.3
VTUNE
  Top 0.2: IC1.11 79.9,32.94 R8.1 81.61,33.14 C20.1

## Text on the board
tPlace: REF IN | AD9913 | OUT5- | GND | PB13 | SCLK | PB14 | SDIO | SI5332 | PB12 | /CS | REF: | PB11 | IO_UPDATE | PB10 | PWR_DWN | PB2 | MRESET | + / G / - | OUT4 | OUT5+ | GND | EXT | SI5332 OUT3 | OUT | CLK IN | REF: | STW81200 | I2C | AD9913 | Loop Filter: | OUT1 | + / G / - | GND | SCL | SDA | R3 | EXT | CP | VTUNE | C2 | R1 | C1 | C2 | C3 | C1 | R2 | OUT0 | + / G / - | +5V | R1 | R2 | R3 | PA9 | PA10 | C3 | SI5332 OUT2 | FL_SW | Supply | GND | 5V | GND | POWER | GND | 5V_USB | PB1 | PD_RF1 | REF IN | HW_PD | PB0 | PA6 | LD/SDO | SDI | CLK | GND | DIO | RST | PA7 | +3V3 | PA5 | SCK | SWD | PB6 | PA4 | LE | TX | GND | GND | UART | RX | PB7 | STW81200/AD9913/SI5332 / Evaluation Board 05/2021 | RF1- | RF1+ | RF2